# EAGLE design rekickNewGeneration002 (EAGLE 5.07)

## Sheet 1 of 4
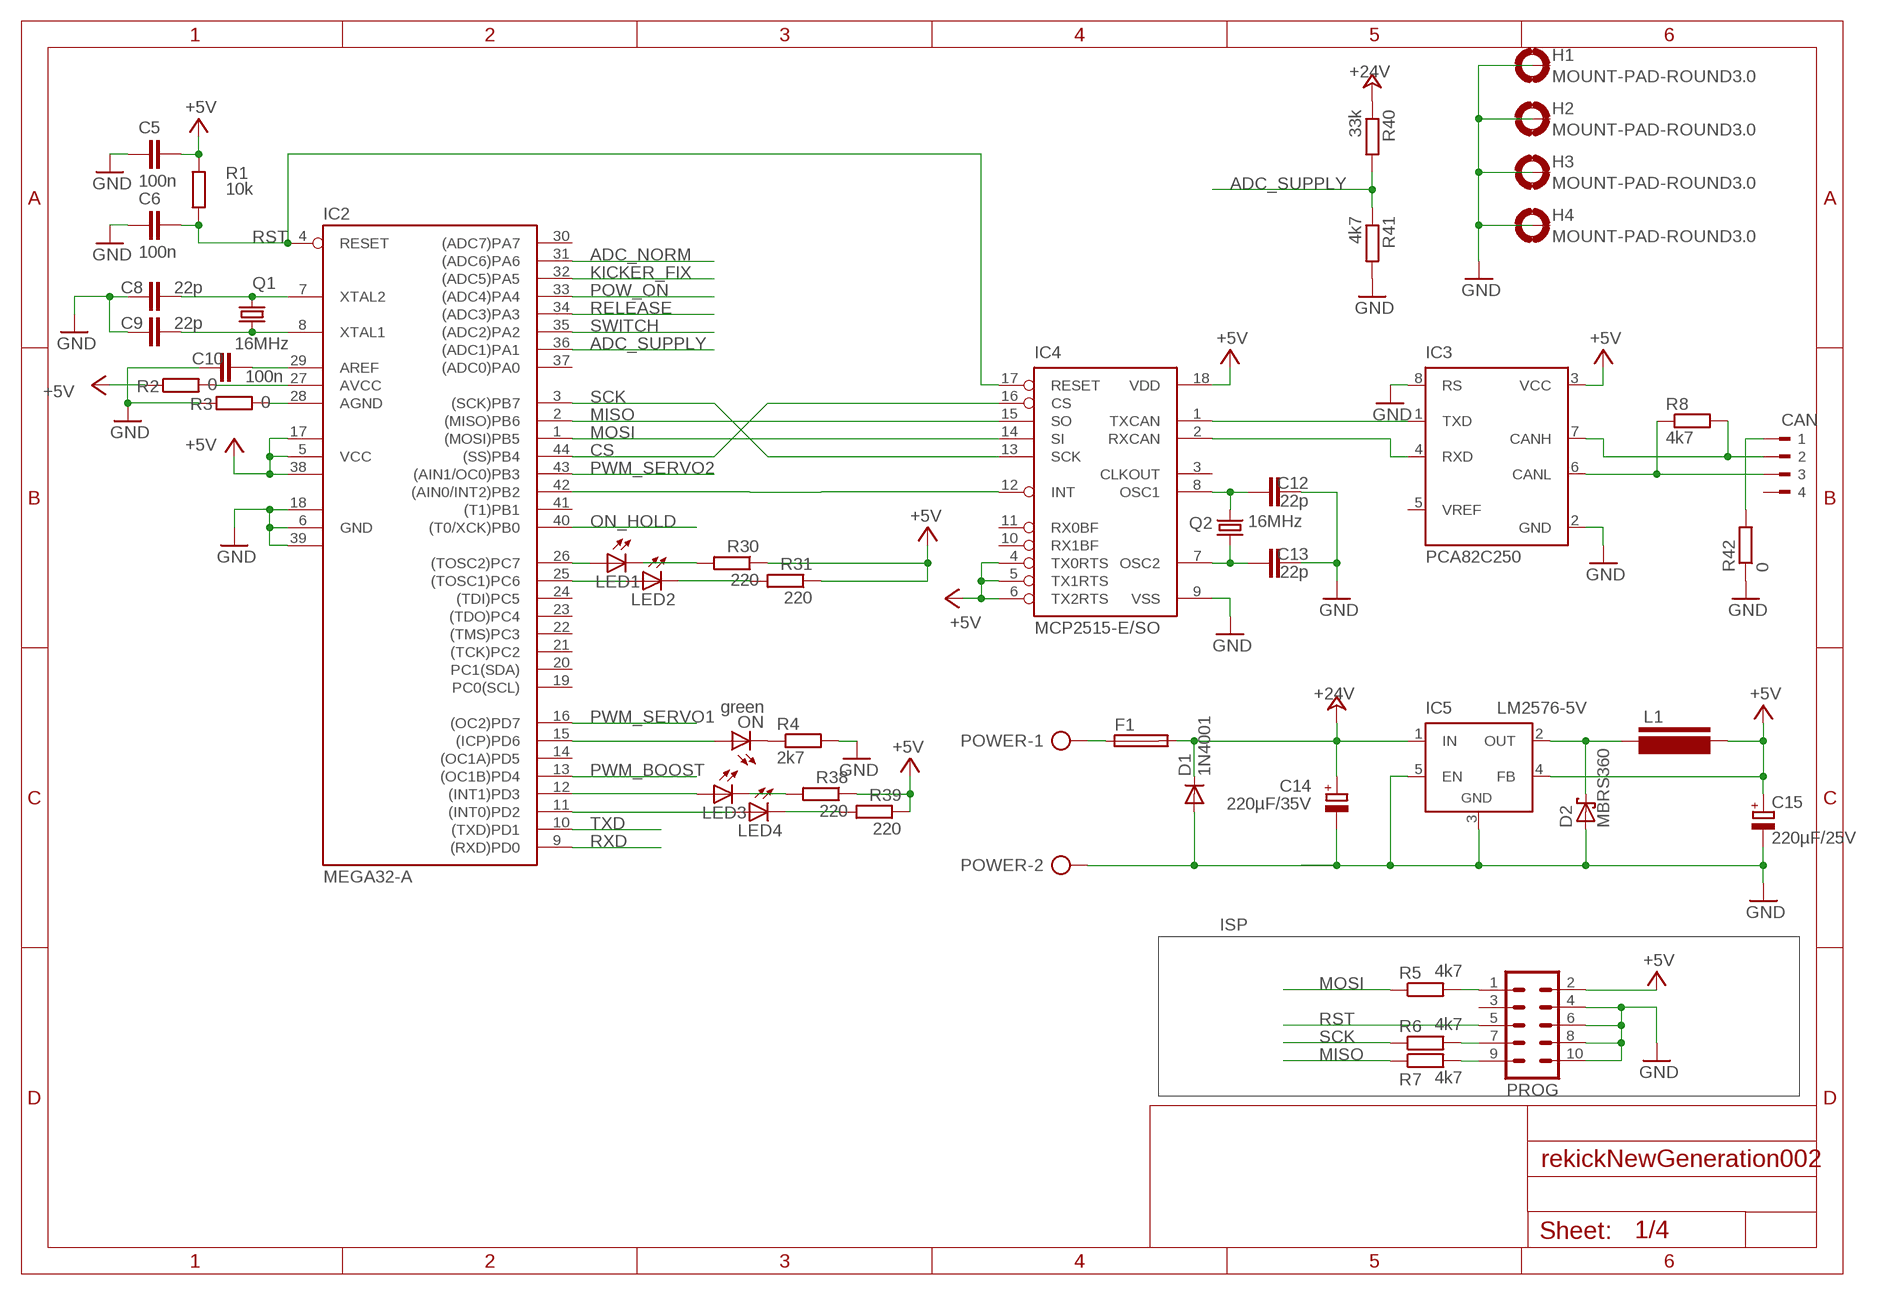
[diagram p0: schematic, sheet 1]

### Parts
C5  100n  C-EUC0603  [C0603]
C6  100n  C-EUC0603  [C0603]
C8  22p  C-EUC0603  [C0603]
C9  22p  C-EUC0603  [C0603]
C10  100n  C-EUC0603  [C0603]
C12  22p  C-EUC0603  [C0603]
C13  22p  C-EUC0603  [C0603]
C14  220µF/35V  CPOL-EUE5-10.5  [E5-10,5]
C15  220µF/25V  CPOL-EUE3.5-10  [E3,5-10]
CAN  90-4  [90-4]
D1  1N4001  1N4004  [DO41-10]
D2  MBRS360  SCHOTTKY-DIODESMC  [SMC]
F1  SH22,5A  [SH22,5A]
H1  MOUNT-PAD-ROUND3.0  [3,0-PAD]
H2  MOUNT-PAD-ROUND3.0  [3,0-PAD]
H3  MOUNT-PAD-ROUND3.0  [3,0-PAD]
H4  MOUNT-PAD-ROUND3.0  [3,0-PAD]
IC2  MEGA32-A  [TQFP44]
IC3  PCA82C250  [DIL08]
IC4  MCP2515-E/SO  [SO18L]
IC5  LM2576-5V  LM2596TV  [TO220-51]
L1  L-PISR  [PISR]
LED1  LEDCHIP-LED0805  [CHIP-LED0805]
LED2  LEDCHIP-LED0805  [CHIP-LED0805]
LED3  LEDCHIP-LED0805  [CHIP-LED0805]
LED4  LEDCHIP-LED0805  [CHIP-LED0805]
ON  green  LED3MM  [LED3MM]
POWER  AK500/2-H  [AK500/2-H]
PROG  ML10  [ML10]
Q1  16MHz  CRYSTALHC49S  [HC49/S]
Q2  16MHz  CRYSTALHC49U-V  [HC49U-V]
R1  10k  R-EU_R0805  [R0805]
R2  0  R-EU_R0805  [R0805]
R3  0  R-EU_R0805  [R0805]
R4  2k7  R-EU_R0805  [R0805]
R5  4k7  R-EU_R0805  [R0805]
R6  4k7  R-EU_R0805  [R0805]
R7  4k7  R-EU_R0805  [R0805]
R8  4k7  R-EU_R0805  [R0805]
R30  220  R-EU_R0805  [R0805]
R31  220  R-EU_R0805  [R0805]
R38  220  R-EU_R0805  [R0805]
R39  220  R-EU_R0805  [R0805]
R40  33k  R-EU_R0805  [R0805]
R41  4k7  R-EU_R0805  [R0805]
R42  0  R-EU_R0805  [R0805]

### Nets
+5V [Power]: C5.2 C15.+ IC2.5(VCC) IC2.17(VCC1) IC2.38(VCC2) IC3.3(VCC) IC4.4(TX0RTS) IC4.5(TX1RTS) IC4.6(TX2RTS) IC4.18(VDD) IC5.4(FB) L1.P$2 PROG.2 R1.2 R2.1 R30.1 R31.1 R38.1 R39.1 ; also sheet 2,3
+24V [Power]: C14.+ D1.C F1.2 IC5.1(IN) R40.1 ; also sheet 2
ADC_NORM: IC2.31((ADC6)PA6) ; also sheet 4
ADC_SUPPLY: IC2.36((ADC1)PA1) R40.2 R41.1
CS: IC2.44((SS)PB4) IC4.16(CS)
GND [Power]: C5.1 C6.1 C8.1 C9.2 C10.1 C12.2 C13.2 C14.- C15.- D1.A D2.A H1.B3,0(MOUNT) H2.B3,0(MOUNT) H3.B3,0(MOUNT) H4.B3,0(MOUNT) IC2.6(GND) IC2.18(GND1) IC2.39(GND2) IC3.2(GND) IC3.8(RS) IC4.9(VSS) IC5.3(GND) IC5.5(EN) POWER.2 PROG.4 PROG.6 PROG.8 PROG.10 R3.1 R4.2 R41.2 R42.1 ; also sheet 2,3,4
KICKER_FIX: IC2.32((ADC5)PA5)
MISO: IC2.2((MISO)PB6) IC4.15(SO) R7.1
MOSI: IC2.1((MOSI)PB5) IC4.14(SI) R5.1
N$1: IC2.15((ICP)PD6) ON.A
N$2: C10.2 IC2.29(AREF)
N$3: IC2.27(AVCC) R2.2
N$4: C9.1 IC2.8(XTAL1) Q1.1
N$5: C8.2 IC2.7(XTAL2) Q1.2
N$6: PROG.1 R5.2
N$7: IC2.28(AGND) R3.2
N$8: PROG.7 R6.2
N$9: PROG.9 R7.2
N$12: IC3.1(TXD) IC4.1(TXCAN)
N$22: IC3.4(RXD) IC4.2(RXCAN)
N$24: CAN.3 IC3.6(CANL) R8.1
N$30 [Power]: D2.C IC5.2(OUT) L1.P$1
N$31: ON.K(C) R4.1
N$42: IC2.42((AIN0/INT2)PB2) IC4.12(INT)
N$43 [Power]: F1.1 POWER.1
N$44: LED2.C R31.2
N$45: LED1.C R30.2
N$46: CAN.1 R42.2
N$48: IC2.26((TOSC2)PC7) LED1.A
N$49: IC2.25((TOSC1)PC6) LED2.A
N$53: C13.1 IC4.7(OSC2) Q2.1
N$54: C12.1 IC4.8(OSC1) Q2.2
N$58: LED3.C R38.2
N$59: CAN.2 IC3.7(CANH) R8.2
N$60: LED4.C R39.2
N$61: IC2.12((INT1)PD3) LED3.A
N$62: IC2.11((INT0)PD2) LED4.A
ON_HOLD: IC2.40((T0/XCK)PB0) ; also sheet 3
POW_ON: IC2.33((ADC4)PA4) ; also sheet 2
PWM_BOOST: IC2.13((OC1B)PD4) ; also sheet 2
PWM_SERVO1: IC2.16((OC2)PD7)
PWM_SERVO2: IC2.43((AIN1/OC0)PB3)
RELEASE: IC2.34((ADC3)PA3) ; also sheet 2
RST: C6.2 IC2.4(RESET) IC4.17(RESET) PROG.5 R1.1 ; also sheet 2
RXD: IC2.9((RXD)PD0)
SCK: IC2.3((SCK)PB7) IC4.13(SCK) R6.1
SWITCH: IC2.35((ADC2)PA2)
TXD: IC2.10((TXD)PD1)
Unconnected: CAN.4 IC2.14((OC1A)PD5) IC2.19(PC0(SCL)) IC2.20(PC1(SDA)) IC2.21((TCK)PC2) IC2.22((TMS)PC3) IC2.23((TDO)PC4) IC2.24((TDI)PC5) IC2.30((ADC7)PA7) IC2.37((ADC0)PA0) IC2.41((T1)PB1) IC3.5(VREF) IC4.3(CLKOUT) IC4.10(RX1BF) IC4.11(RX0BF) PROG.3

### Notes on the sheet
- ISP

## Sheet 2 of 4
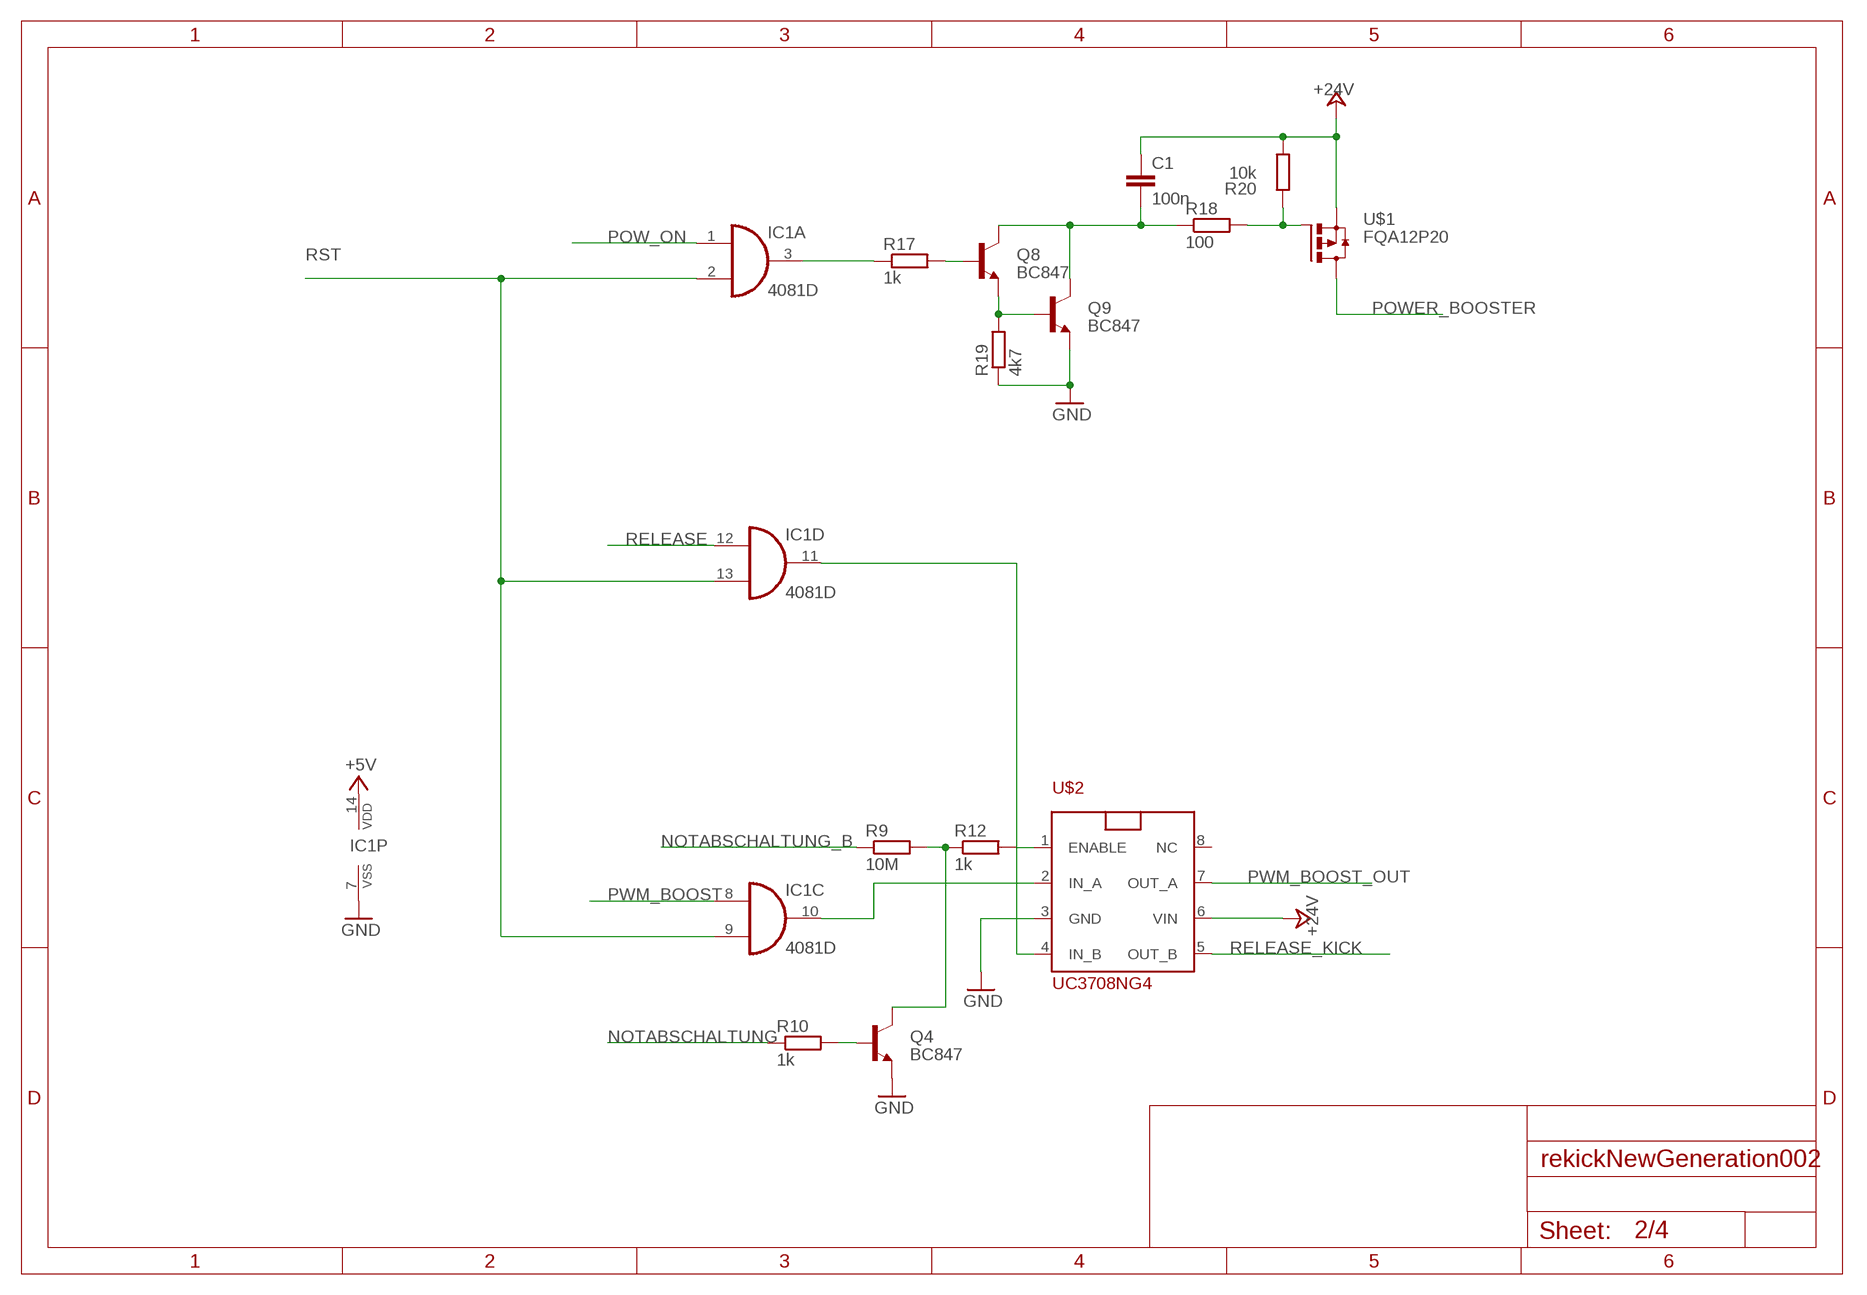
[diagram p1: schematic, sheet 2]

### Parts
C1  100n  C-EUC0603  [C0603]
IC1  4081D  [SO14]
Q4  BC847  BC817-25SMD  [SOT23-BEC]
Q8  BC847  BC817-25SMD  [SOT23-BEC]
Q9  BC847  BC817-25SMD  [SOT23-BEC]
R9  10M  R-EU_R0805  [R0805]
R10  1k  R-EU_R0805  [R0805]
R12  1k  R-EU_R0805  [R0805]
R17  1k  R-EU_R0805  [R0805]
R18  100  R-EU_R0805  [R0805]
R19  4k7  R-EU_R0805  [R0805]
R20  10k  R-EU_R0805  [R0805]
U$1  FQA12P20  [TO247BV]
U$2  UC3708NG4  [DIL08]

### Nets
+5V [Power]: IC1.14(P:VDD) ; also sheet 1,3
+24V [Power]: C1.1 R20.1 U$1.S U$2.6(VIN) ; also sheet 1
GND [Power]: IC1.7(P:VSS) Q4.E Q9.E R19.1 U$2.3(GND) ; also sheet 1,3,4
N$11: R12.2 U$2.1(ENABLE)
N$15: Q4.B R10.2
N$19: IC1.11(D:O) U$2.4(IN_B)
N$29: R18.2 R20.2 U$1.G
N$36: IC1.10(C:O) U$2.2(IN_A)
N$47: IC1.3(A:O) R17.1
N$63 [Power]: C1.2 Q8.C Q9.C R18.1
N$64: Q8.E Q9.B R19.2
N$65: Q8.B R17.2
N$100: Q4.C R9.2 R12.1
NOTABSCHALTUNG: R10.1 ; also sheet 3
NOTABSCHALTUNG_B: R9.1 ; also sheet 3
POW_ON: IC1.1(A:I0) ; also sheet 1
POWER_BOOSTER: U$1.D ; also sheet 3
PWM_BOOST: IC1.8(C:I0) ; also sheet 1
PWM_BOOST_OUT: U$2.7(OUT_A) ; also sheet 3
RELEASE: IC1.12(D:I0) ; also sheet 1
RELEASE_KICK: U$2.5(OUT_B) ; also sheet 4
RST: IC1.2(A:I1) IC1.9(C:I1) IC1.13(D:I1) ; also sheet 1
Unconnected: IC1.4(B:O) IC1.5(B:I0) IC1.6(B:I1) U$2.8(NC)

## Sheet 3 of 4
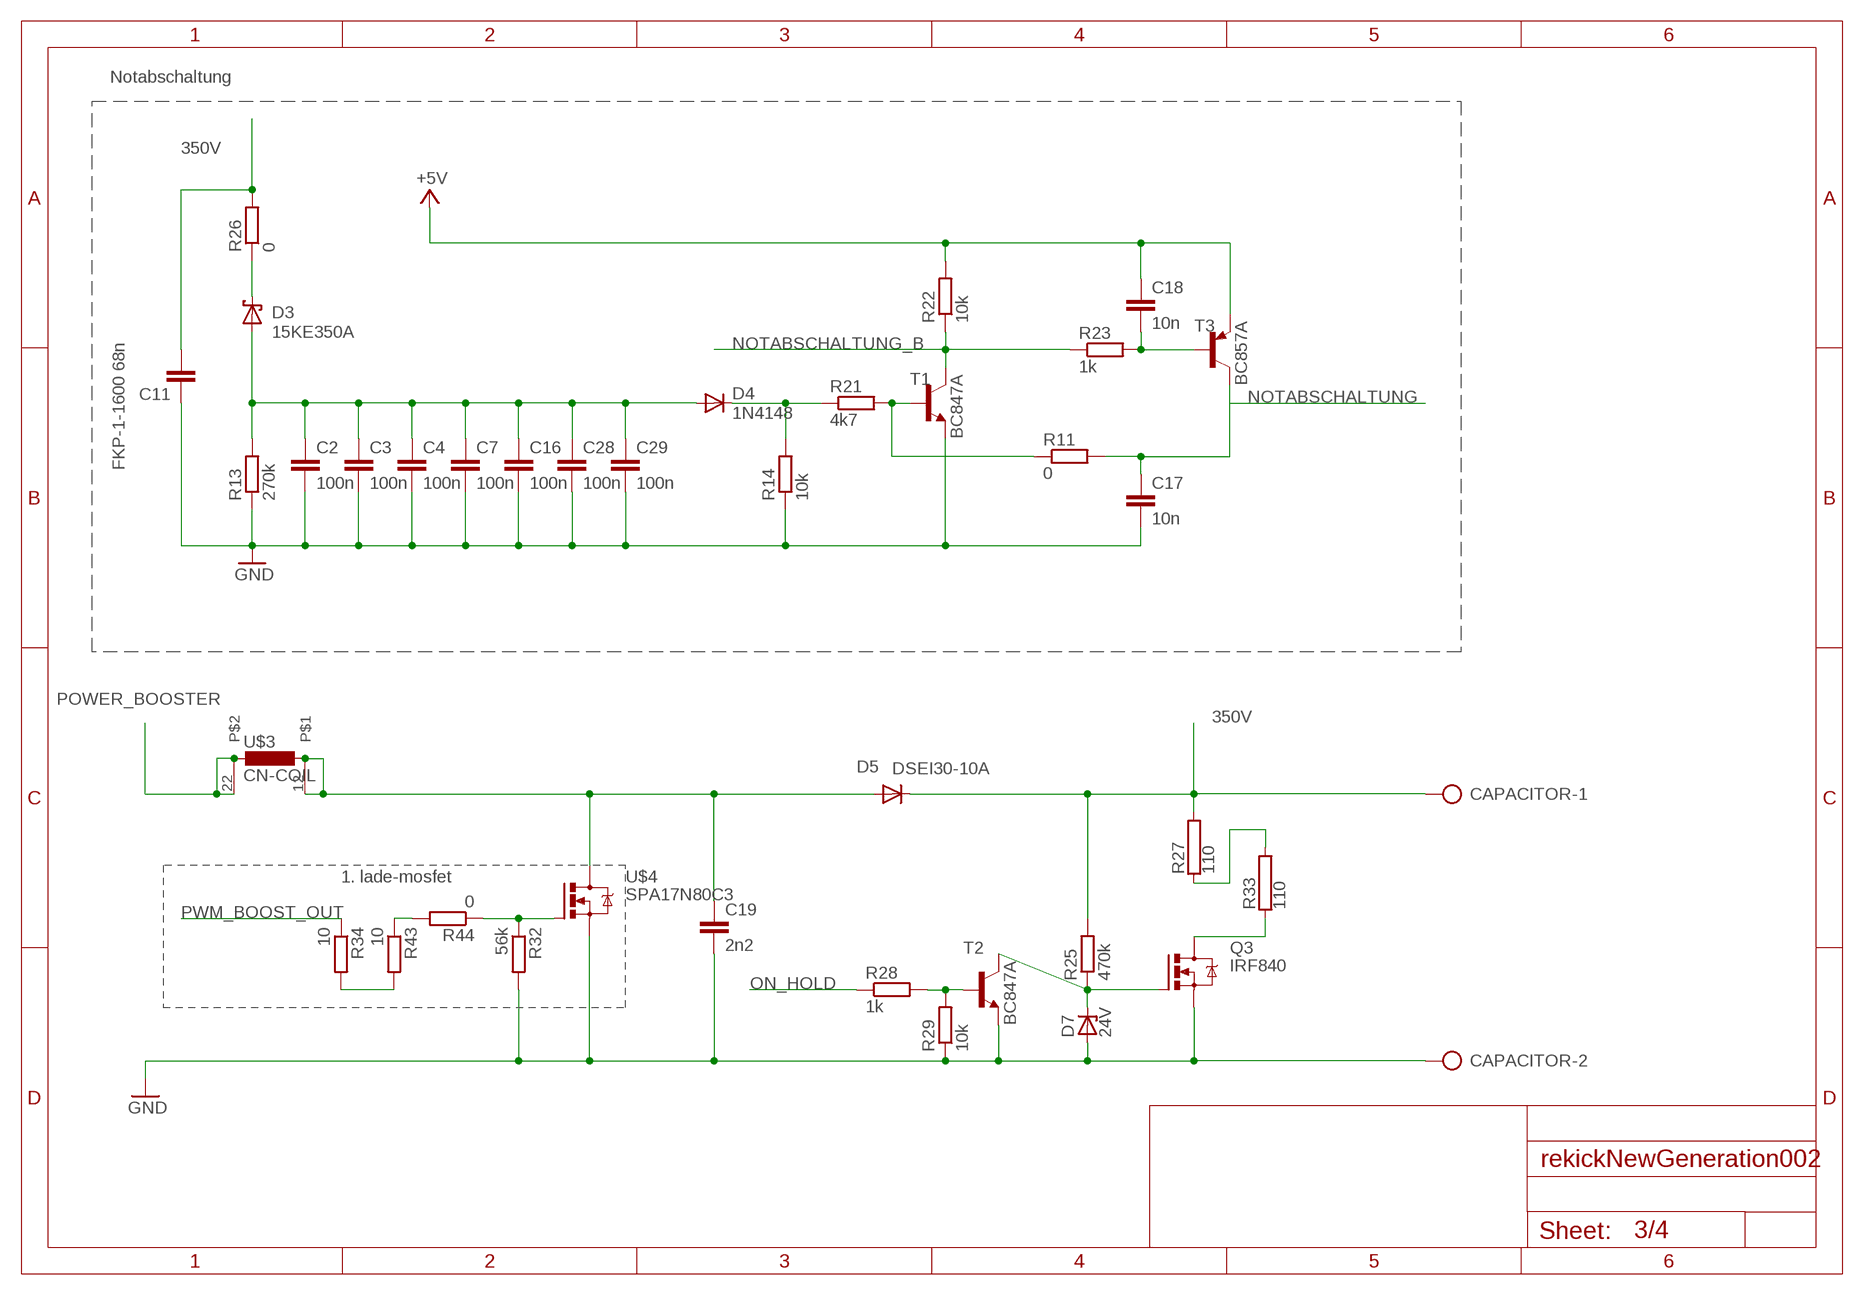
[diagram p2: schematic, sheet 3]

### Parts
C2  100n  C-EUC0603  [C0603]
C3  100n  C-EUC0603  [C0603]
C4  100n  C-EUC0603  [C0603]
C7  100n  C-EUC0603  [C0603]
C11  FKP-1-1600 68n  C-EU375-192X418  [C375-192X418]
C16  100n  C-EUC0603  [C0603]
C17  10n  C-EUC0603  [C0603]
C18  10n  C-EUC0603  [C0603]
C19  2n2  C-EU150-054X183  [C150-054X183]
C28  100n  C-EUC0603  [C0603]
C29  100n  C-EUC0603  [C0603]
CAPACITOR  AK500/2-H  [AK500/2-H]
D3  15KE350A  15KEXX  [CB429-17]
D4  1N4148  [DO35-10]
D5  DSEI30-10A  DEIS10-30A  [TO247AD]
D7  24V  ZENER-DIODEDO35Z10  [DO35Z10]
Q3  IRF840  IRF740  [TO220BV]
R11  0  R-EU_R0805  [R0805]
R13  270k  R-EU_R0805  [R0805]
R14  10k  R-EU_R0805  [R0805]
R21  4k7  R-EU_R0805  [R0805]
R22  10k  R-EU_R0805  [R0805]
R23  1k  R-EU_R0805  [R0805]
R25  470k  R-EU_R0805  [R0805]
R26  0  R-EU_0207/15  [0207/15]
R27  110  RHS25  [HS25]
R28  1k  R-EU_R0805  [R0805]
R29  10k  R-EU_R0805  [R0805]
R32  56k  R-EU_R0805  [R0805]
R33  110  RHS25  [HS25]
R34  10  R-EU_R0805  [R0805]
R43  10  R-EU_R0805  [R0805]
R44  0  R-EU_R0805  [R0805]
T1  BC847A  BC817-25-NPN-SOT23-BEC  [SOT23-BEC]
T2  BC847A  BC817-25-NPN-SOT23-BEC  [SOT23-BEC]
T3  BC857A  BC807-25-PNP-SOT23-BEC  [SOT23-BEC]
U$3  CN-COIL  [CN-TJ6-U1-2]
U$4  SPA17N80C3  [TO220BV]

### Nets
350V: C11.2 CAPACITOR.1 D5.K(C) R25.2 R26.2 R27.2 ; also sheet 4
+5V [Power]: C18.1 R22.2 T3.E ; also sheet 1,2
GND [Power]: C2.2 C3.2 C4.2 C7.2 C11.1 C16.2 C17.2 C19.2 C28.2 C29.2 CAPACITOR.2 D7.A Q3.S R13.1 R14.1 R29.1 R32.2 T1.E T2.E U$4.S ; also sheet 1,2,4
N$14: C2.1 C3.1 C4.1 C7.1 C16.1 C28.1 C29.1 D3.A D4.A R13.2
N$16: C18.2 R23.2 T3.B
N$18: R11.1 R21.2 T1.B
N$20: R34.2 R43.2
N$23 [Power]: C19.1 D5.A U$3.11 U$3.12 U$4.D
N$25: R32.1 R44.1 U$4.G
N$27: D4.C R14.2 R21.1
N$28: D3.C R26.1
N$32: Q3.D R33.1
N$33: R27.1 R33.2
N$34: D7.C Q3.G R25.1 T2.C
N$38: R28.2 R29.2 T2.B
N$50: R43.1 R44.2
NOTABSCHALTUNG: C17.1 R11.2 T3.C ; also sheet 2
NOTABSCHALTUNG_B: R22.1 R23.1 T1.C ; also sheet 2
ON_HOLD: R28.1 ; also sheet 1
POWER_BOOSTER: U$3.21 U$3.22 ; also sheet 2
PWM_BOOST_OUT: R34.1 ; also sheet 2

### Notes on the sheet
- Notabschaltung
- 1. lade-mosfet

## Sheet 4 of 4
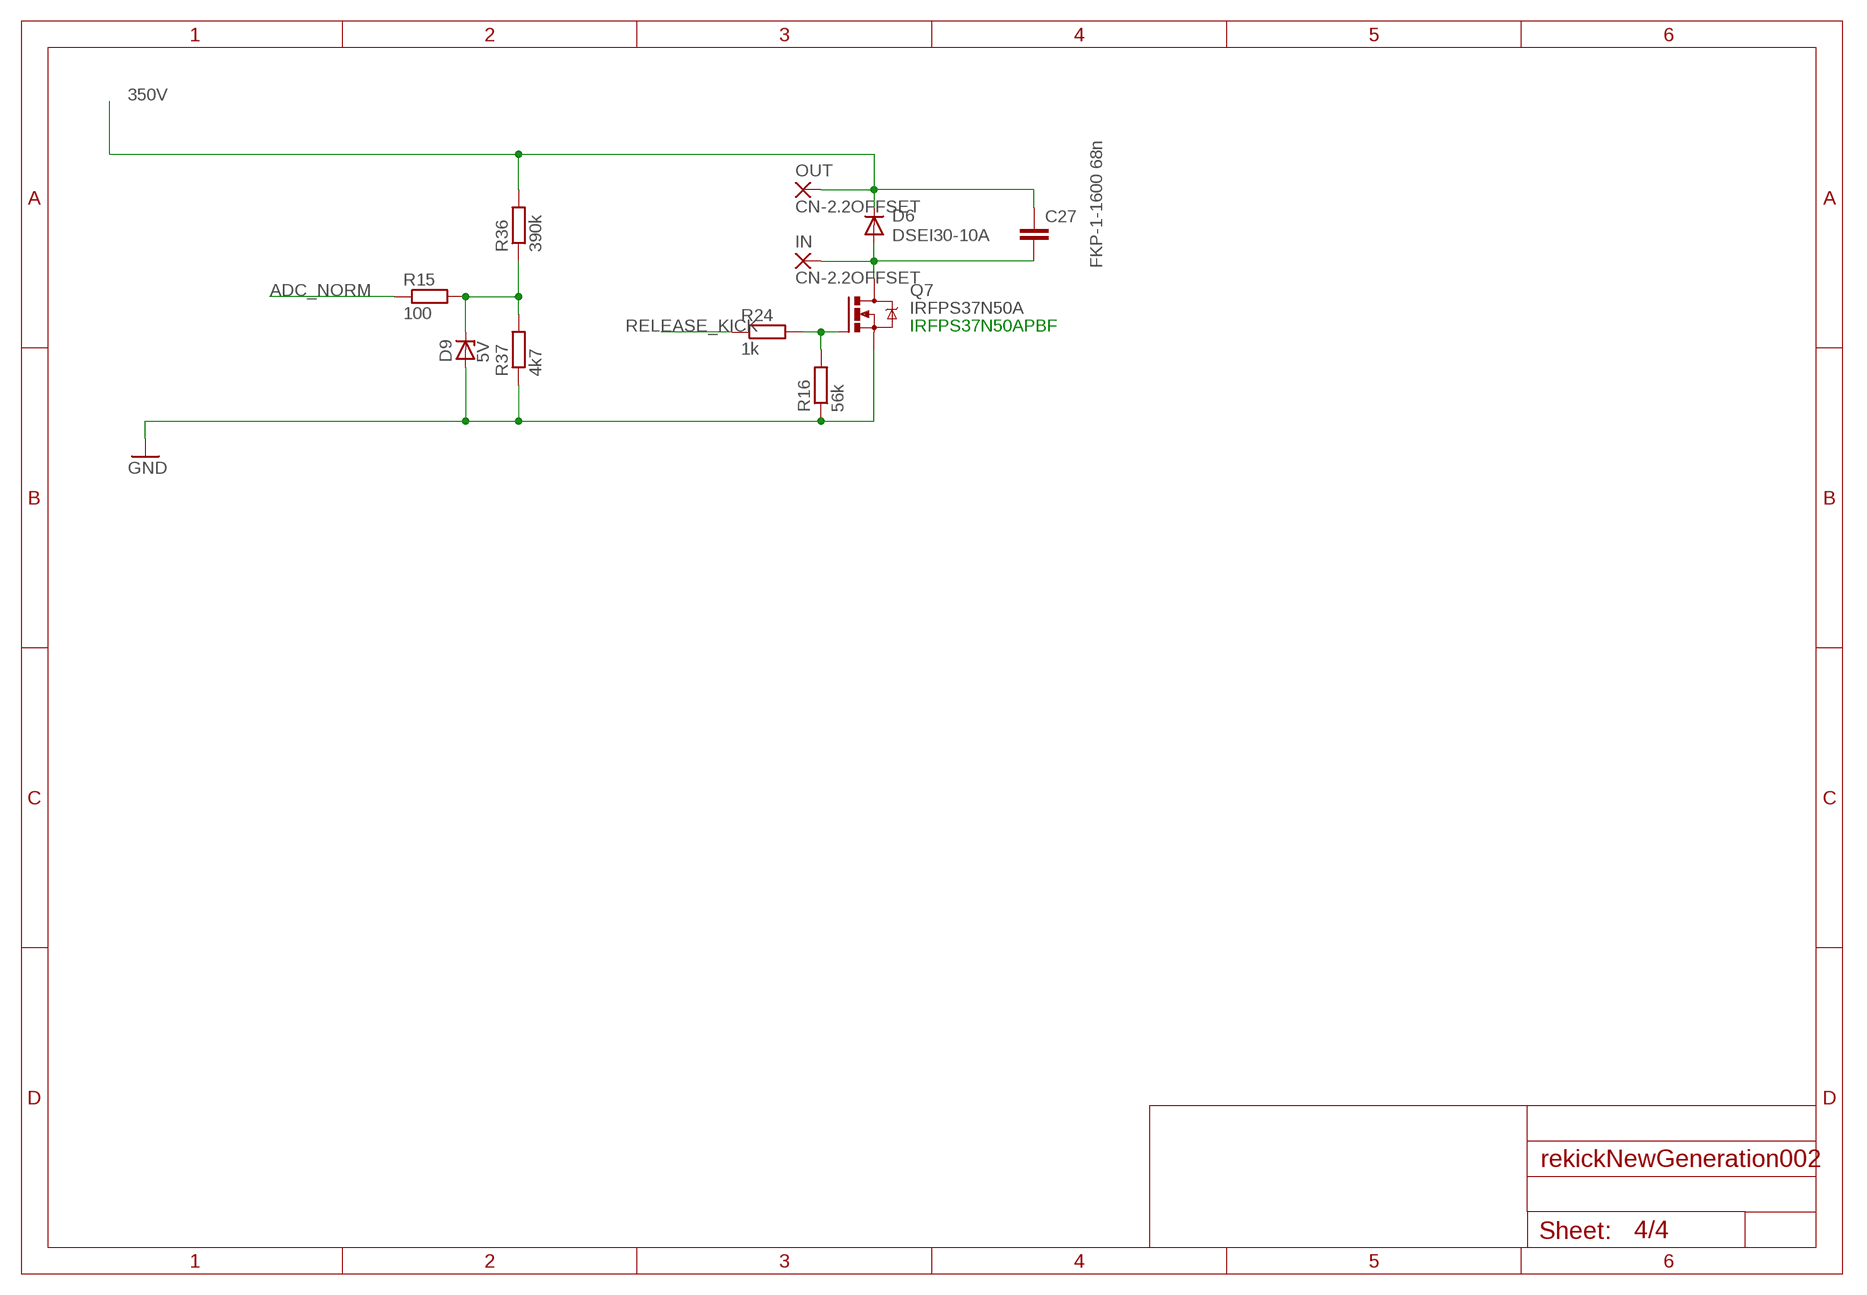
[diagram p3: schematic, sheet 4]

### Parts
C27  FKP-1-1600 68n  C-EU375-192X418  [C375-192X418]
D6  DSEI30-10A  DEIS10-30A  [TO247AD]
D9  5V  ZENER-DIODESOT23  [SOT23]
IN  CN-2.2OFFSET  [CN-2,1]
OUT  CN-2.2OFFSET  [CN-2,1]
Q7  IRFPS37N50A  IRFPC40  [TO247BV]
R15  100  R-EU_R0805  [R0805]
R16  56k  R-EU_R0805  [R0805]
R24  1k  R-EU_R0805  [R0805]
R36  390k  R-EU_0207/15  [0207/15]
R37  4k7  R-EU_0207/15  [0207/15]

### Nets
350V: C27.1 D6.K(C) OUT.>NAME(P) R36.2 ; also sheet 3
ADC_250V1: D9.3(C) R15.2 R36.1 R37.2
ADC_NORM: R15.1 ; also sheet 1
GND [Power]: D9.1(A) Q7.S R16.1 R37.1 ; also sheet 1,2,3
N$10: Q7.G R16.2 R24.2
N$55: C27.2 D6.A IN.>NAME(P) Q7.D
RELEASE_KICK: R24.1 ; also sheet 2

### Notes on the sheet
- IRFPS37N50APBF

## Library data of the parts
C1-C13 C16-C19 C27-C29 = rcl:C-EU: CAPACITOR, European symbol
C14 C15 = rcl:CPOL-EU: POLARIZED CAPACITOR, European symbol
CAN = con-weidmueller-sl35:90-4: WEIDMUELLER CLAMP CONNECTOR
CAPACITOR POWER = con-ptr500:AK500/2-H: CONNECTOR Aug. 2004 / PTR Meßtechnik: Die Bezeichnung der Serie AK505 wurde geändert. Es handelt sich hierbei um AK500 in horizontaler Ausführung.
D1 = diode:1N4004: DIODE general purpose rectifier, 1 A
D2 = diode:SCHOTTKY-DIODE: Schottky Diode
D3 = diode:15KEXX: DIODE
D4 = diode:1N4148: DIODE high speed (Philips)
D5 D6 = carpenoctem:DEIS10-30A
D7 D9 = diode:ZENER-DIODE: Z-Diode
F1 = fuse:SH22,5A: FUSE HOLDER grid 22,5mm, isolated cap OGN0031 8201, Schurter (Buerklin)
H1-H4 = holes:MOUNT-PAD-ROUND: MOUNTING PAD, round
IC1 = 40xx:4081: Quad 2-input AND
IC2 = atmel:MEGA32: MICROCONTROLLER 32 Kbytes FLASH 2 Kbytes SRAM 1 Kbytes EEPROM USART 8-channel 10 bit ADC Source: www.atmel.com .. doc2503.pdf
IC3 = micro-philips:PCA82C250: CAN CONTROLLER INTERFACE
IC4 = mcp2515:MCP2515
IC5 = linear:LM2596T: STEP-DOWN VOLTAGE REGULATOR
IN OUT = mywirepad:CN-2.2OFFSET
L1 = L-PISR:L-PISR: Fastron SMD Power Inductors (also Shielded) - PISR Series Data Sheet <http://www.fastrongroup.com/products/inductors/pdf/PISR.pdf> Part No Inductance L (µH) fL (MHz) Tol ± (%) SRF min (MHz) DCR max (Ω) Rated DC Current | sat (A) | Δ T = 40°C (A) PISR-1R0M-04 1.0 0.1 20 164 0.009 21 8.60 PISR-2R2M-04 2.2 0.1 20 95 0.014 16 7.10 PISR-3R3M-04 3.3 0.1 20 72 0.017 15 6.40 PISR-4R7M-04 4.7 0.1 20 52 0.019 13 5.80 PISR-5R6M-04 5.6 0.1 20 41 0.022 12 5.50 PISR-6R8M-04 6.8 0.1 20 35 0.024 11 5.20 PISR-100M-04 10 0.1 20 24 0.029 10 4.50 PISR-150M-04 15 0.1 20 20 0.035 8.0 4.10 PISR-220M-04 22 0.1 20 15 0.04 7.0 3.60 PISR-330M-04 33 0.1 20 10 0.06 5.6 3.10 PISR-470M-04 47 0.1 20 8 0.07 4.6 2.70 PISR-680M-04 68 0.1 20 6.5 0.10 3.6 2.30 PISR-101M-04 100 0.1 20 5.2 0.17 3.1 1.90 PISR-151M-04 150 0.1 20 4.2 0.22 2.6 1.60 PISR-221M-04 220 0.1 20 3.3 0.34 2.2 1.30 PISR-331M-04 330 0.1 20 2.7 0.52 1.9 1.10 PISR-471M-04 470 0.1 20 2.1 0.76 1.4 0.85 PISR-681M-04 680 0.1 20 1.8 1.1 1.2 0.74 PISR-102M-04 1000 0.1 20 1.3 1.7 1.0 0.57
LED1-LED4 ON = led:LED: LED OSRAM: - CHIPLED LG R971, LG N971, LY N971, LG Q971, LY Q971, LO R971, LY R971 LH N974, LH R974 LS Q976, LO Q976, LY Q976 LO Q996 - Hyper CHIPLED LW Q18S LB Q993, LB Q99A, LB R99A - SideLED LS A670, LO A670, LY A670, LG A670, LP A670 LB A673, LV A673, LT A673, LW A673 LH A674 LY A675 LS A676, LA A676, LO A676, LY A676, LW A676 LS A679, LY A679, LG A679 - Hyper Micro SIDELED® LS Y876, LA Y876, LO Y876, LY Y876 LT Y87S - SmartLED LW L88C, LW L88S LB L89C, LB L89S, LG L890 LS L89K, LO L89K, LY L89K LS L896, LA L896, LO L896, LY L896 - TOPLED LS T670, LO T670, LY T670, LG T670, LP T670 LSG T670, LSP T670, LSY T670, LOP T670, LYG T670 LG T671, LOG T671, LSG T671 LB T673, LV T673, LT T673, LW T673 LH T674 LS T676, LA T676, LO T676, LY T676, LB T676, LH T676, LSB T676, LW T676 LB T67C, LV T67C, LT T67C, LS T67K, LO T67K, LY T67K, LW E67C LS E67B, LA E67B, LO E67B, LY E67B, LB E67C, LV E67C, LT E67C LW T67C LS T679, LY T679, LG T679 LS T770, LO T770, LY T770, LG T770, LP T770 LB T773, LV T773, LT T773, LW T773 LH T774 LS E675, LA E675, LY E675, LS T675 LS T776, LA T776, LO T776, LY T776, LB T776 LHGB T686 LT T68C, LB T68C - Hyper Mini TOPLED® LB M676 - Mini TOPLED Santana® LG M470 LS M47K, LO M47K, LY M47K Source: http://www.osram.convergy.de - LUMILED® LXK2-PW12-R00, LXK2-PW12-S00, LXK2-PW14-U00, LXK2-PW14-V00 LXK2-PM12-R00, LXK2-PM12-S00, LXK2-PM14-U00 LXK2-PE12-Q00, LXK2-PE12-R00, LXK2-PE12-S00, LXK2-PE14-T00, LXK2-PE14-U00 LXK2-PB12-K00, LXK2-PB12-L00, LXK2-PB12-M00, LXK2-PB14-N00, LXK2-PB14-P00, LXK2-PB14-Q00 LXK2-PR12-L00, LXK2-PR12-M00, LXK2-PR14-Q00, LXK2-PR14-R00 LXK2-PD12-Q00, LXK2-PD12-R00, LXK2-PD12-S00 LXK2-PH12-R00, LXK2-PH12-S00 LXK2-PL12-P00, LXK2-PL12-Q00, LXK2-PL12-R00 Source: www.luxeon.com
PROG = con-harting-ml:ML10: HARTING
Q1 Q2 = crystal:CRYSTAL: CRYSTAL
Q3 = transistor-power:IRF740: N-CHANNEL MOS FET
Q4 Q8 Q9 = transistor-npn:BC817*: NPN Transistor
Q7 = transistor-power:IRFPC40: N-CHANNEL MOS FET
R1-R26 R28-R32 R34 R36-R44 = rcl:R-EU_: RESISTOR, European symbol
R27 R33 = resistor-power:R: Power Resitor
T1 T2 = transistor:*-NPN-: NPN Transistror
T3 = transistor:*-PNP-: PNP Transistror
U$1 = carpenoctem:FQA12P20
U$2 = rekickNewGeneration:UC3708NG4
U$3 = myrcl:CN-COIL
U$4 = rekickNewGeneration:SPA17N80C3

## Net classes
1 Power: width 0.406 mm
2 High Power: width 2 mm

## Board
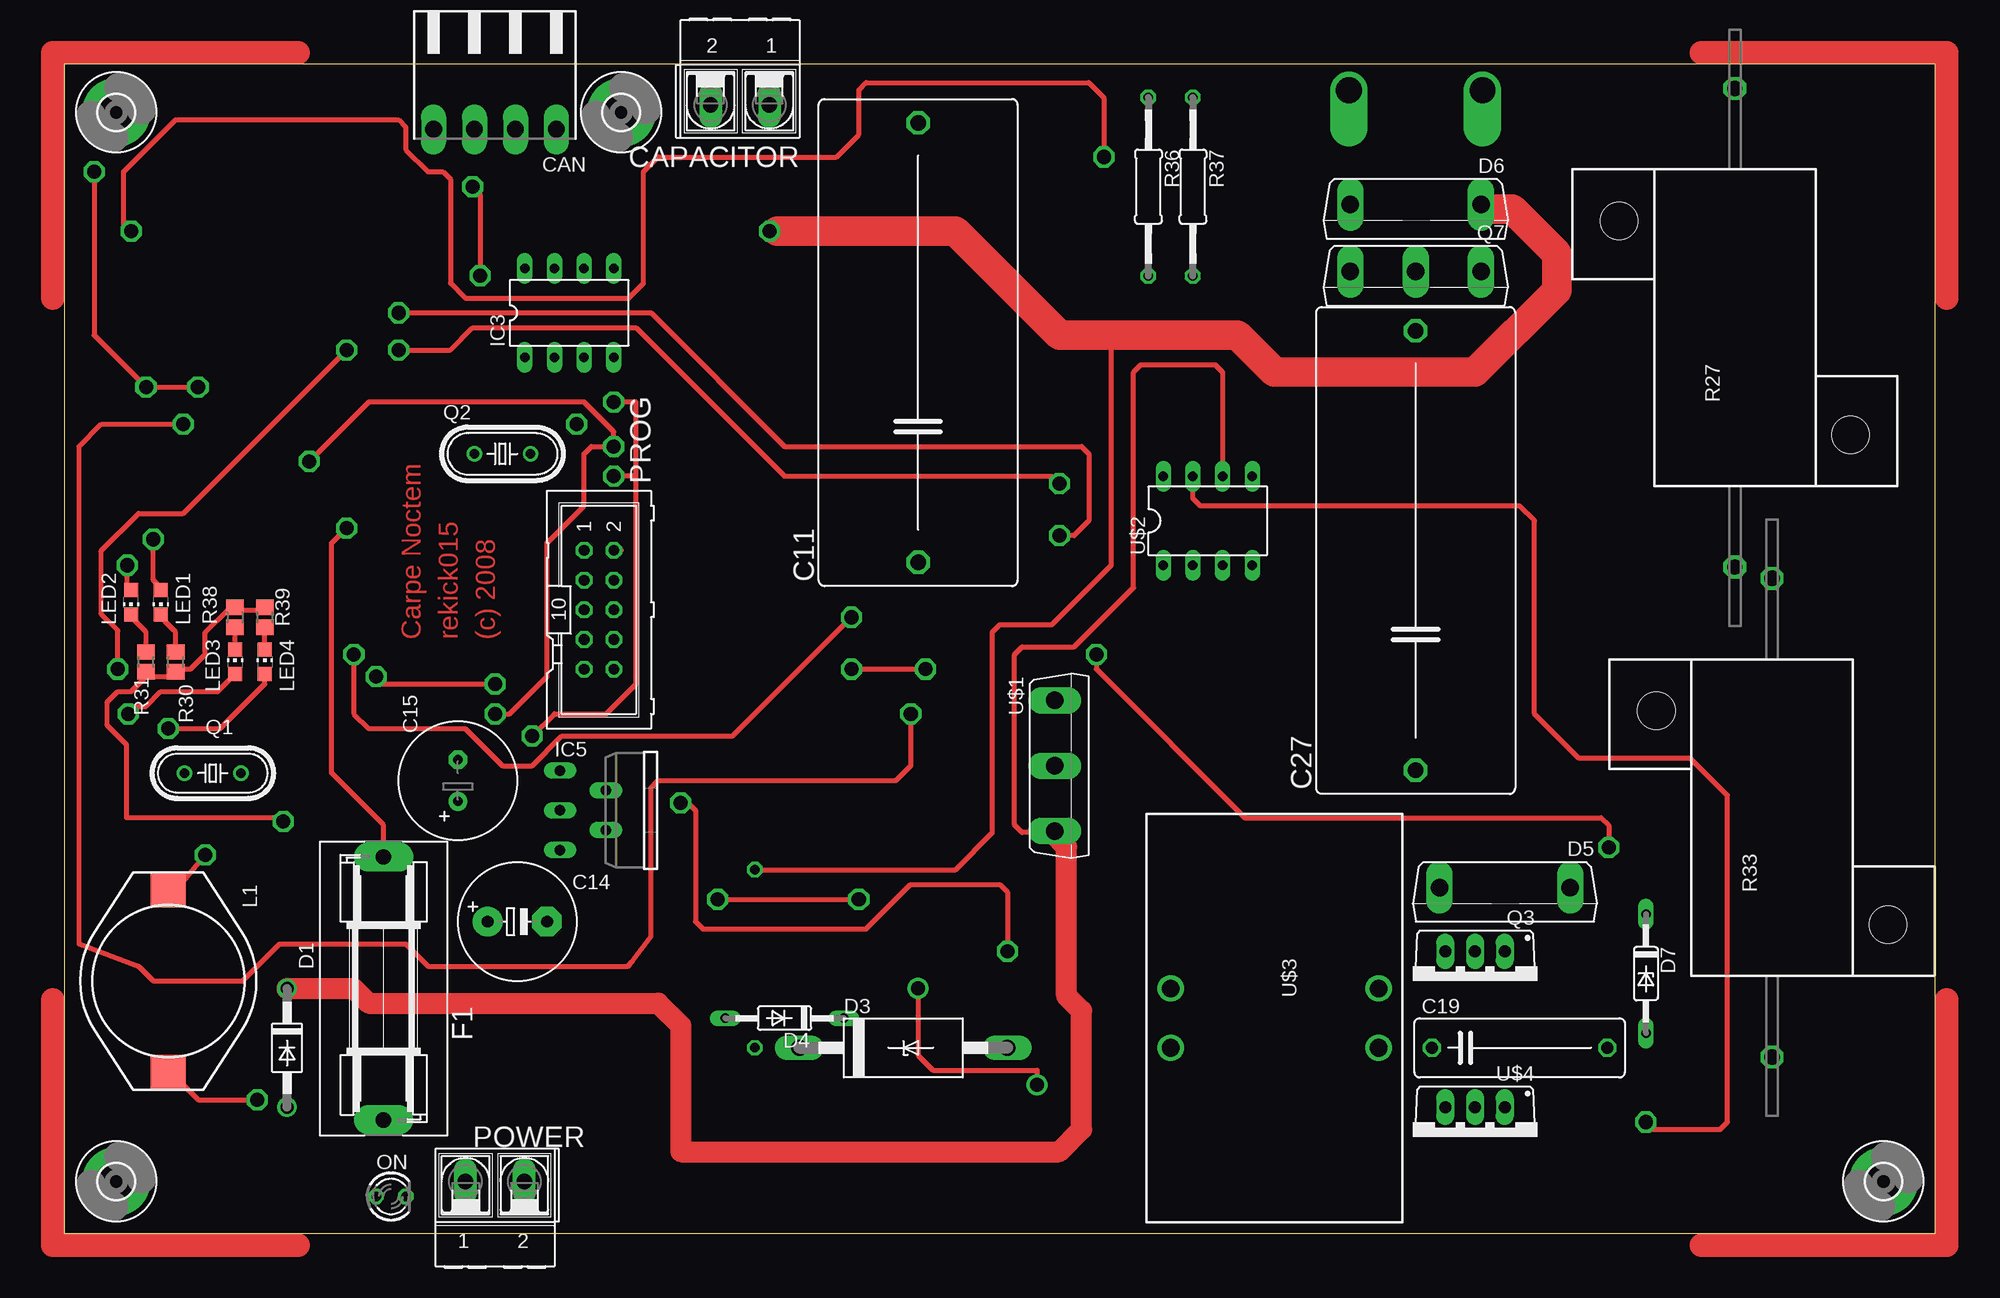
[diagram p4: board, top side]
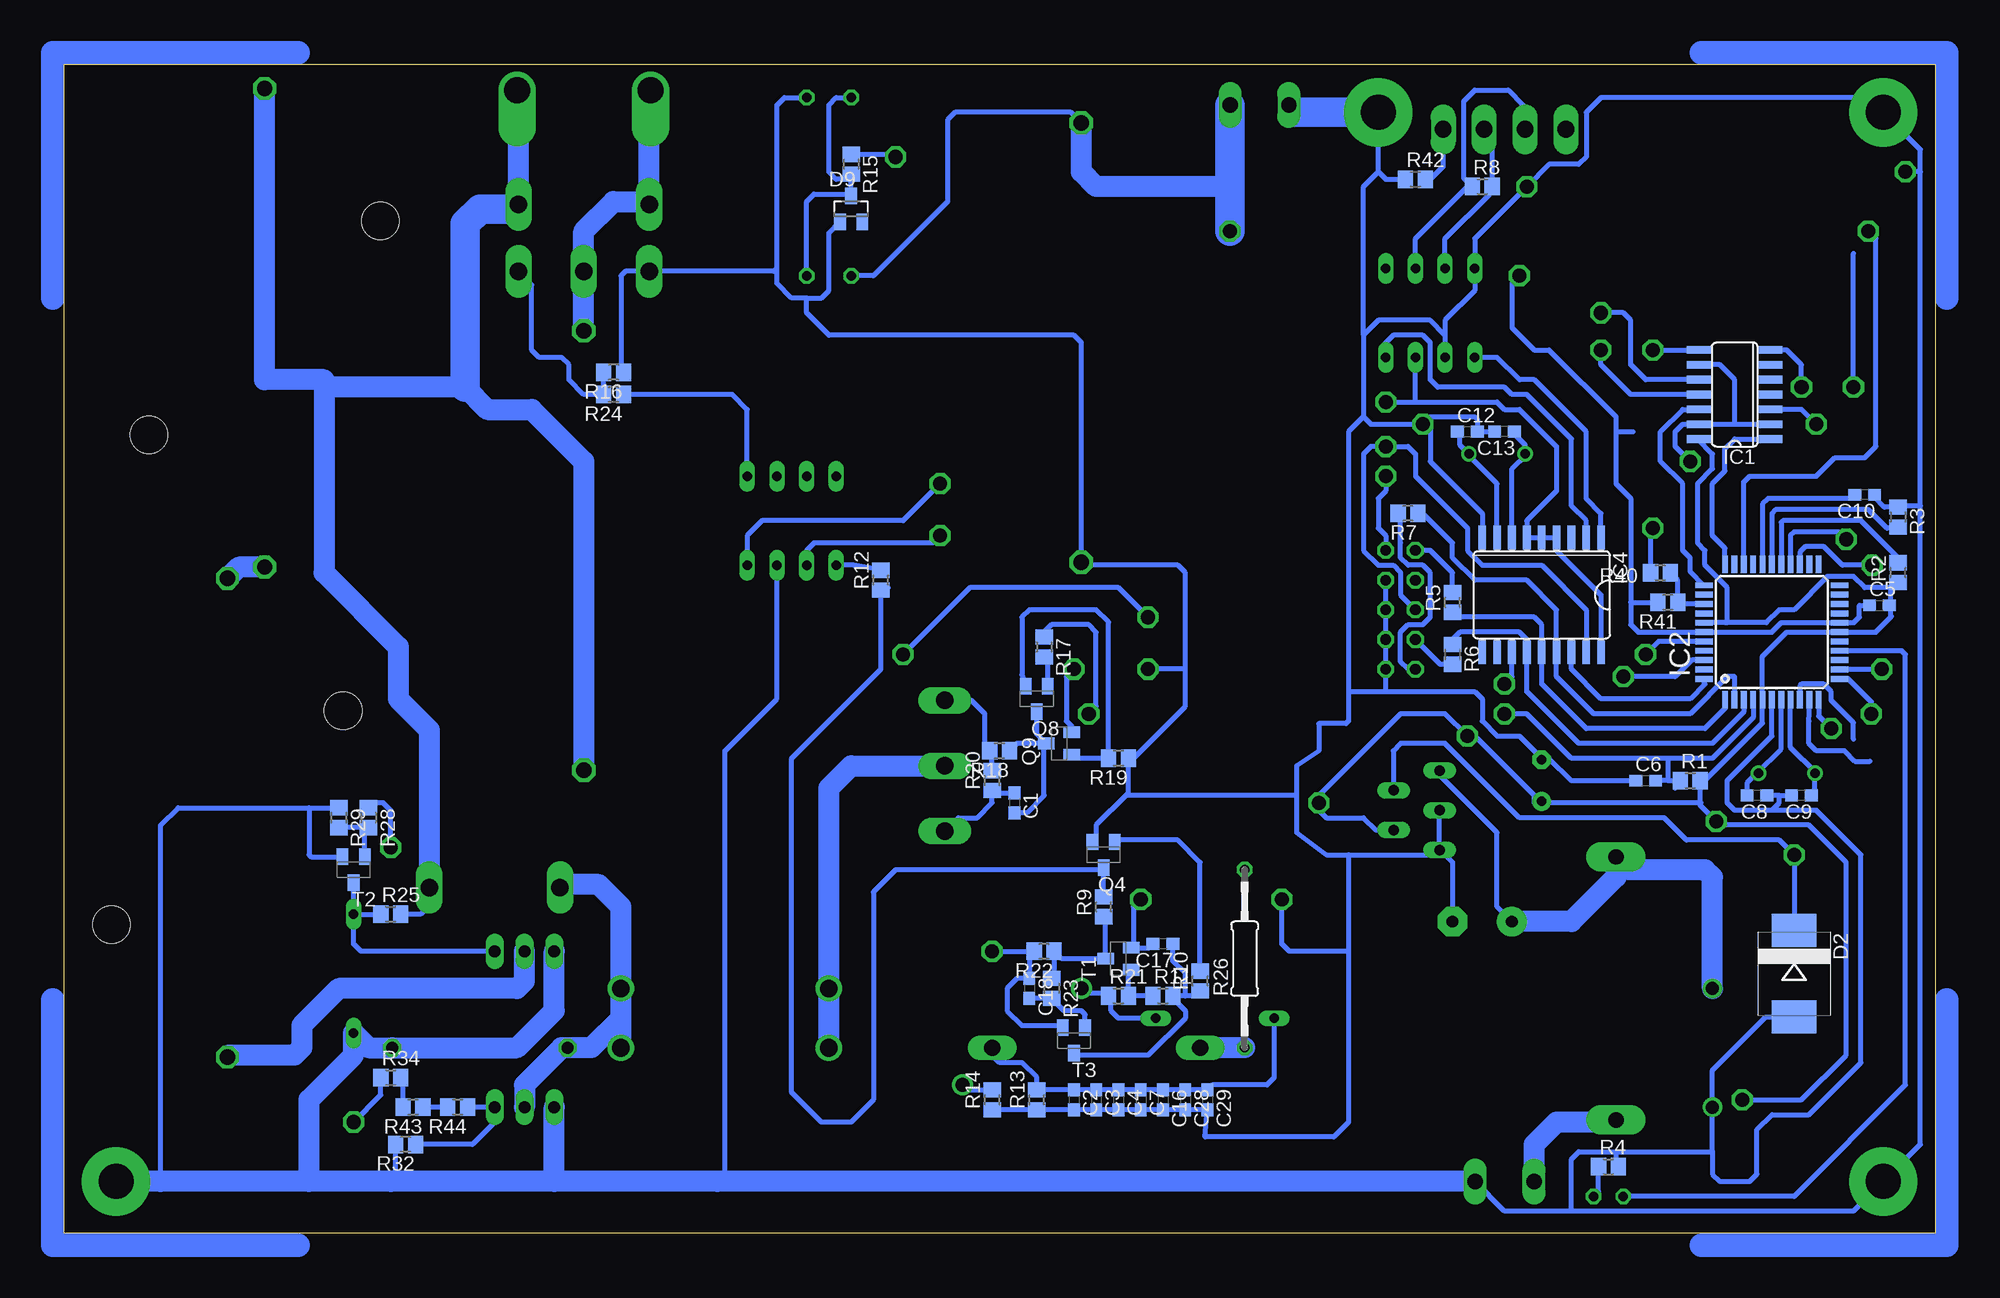
[diagram p5: board, bottom side, seen from below]

Size 160 x 100 mm. Coordinates in mm from the lower left corner, seen from the top.
Outline: 0,0 160,0 160,100 0,100 0,0
Copper layers (1*16): Top 0.035mm / dielectric 1.5mm / Bottom 0.035mm
Design rules "olimex_10mils": minimum track width 10mil, minimum drill 24mil, track to track 10mil, track to pad 10mil, pad to pad 10mil, via to via 10mil, smd to smd 10mil, copper to edge 40mil, drill to drill 10mil, minimum pad ring 10mil, minimum via ring 8mil, stop-mask expansion 0mil, vias tented up to drill 0mil, thermal gap 10mil

### Footprints (pad centres in the part's own frame; a part is rotated, then mirrored left to right if it is on the bottom)
C0603 = smd 1.1 x 1: 1 -0.85,0; 2 0.85,0
C375-192X418 = drill 1.321 octagon: 1 -18.796,0; 2 18.796,0
E5-10,5 = drill 1.016 pad 2.54 round: + -2.54,0 | drill 1.016 pad 2.54 octagon: - 2.54,0
E3,5-10 = drill 0.813 pad 1.6 round: + -1.778,0 | drill 0.813 pad 1.6 octagon: - 1.778,0
C150-054X183 = drill 1.016 octagon: 1 -7.493,0; 2 7.493,0
90-4 = drill 1.422 long: 1 -5.25,5.25; 2 -1.75,5.25; 3 1.75,5.25; 4 5.25,5.25
AK500/2-H = drill 1.321 long: 1 -2.515,0; 2 2.515,0
DO41-10 = drill 1.118 round: A 5.08,0; C -5.08,0
SMC = smd 2.8 x 3.8: A 3.7,0; C -3.7,0
CB429-17 = drill 1.397 long: A 8.89,0; C -8.89,0
DO35-10 = drill 0.813 long: A 5.08,0; C -5.08,0
TO247AD = drill 1.499 long: A 5.588,-0.381; K -5.588,-0.381
DO35Z10 = drill 0.813 long: A 5.08,0; C -5.08,0
SOT23 = smd 1 x 1.4: 1 -0.95,-1.1; 2 0.95,-1.1; 3 0,1.1
SH22,5A = drill 1.321 pad 2.54 long: 1 -11.252,0; 2 11.252,0
3,0-PAD = drill 3 pad 5.842 round: B3,0 0,0
SO14 = smd 0.66 x 2.032: 1 -3.81,-3.073; 2 -2.54,-3.073; 3 -1.27,-3.073; 4 0,-3.073; 5 1.27,-3.073; 6 2.54,-3.073; 7 3.81,-3.073; 8 3.81,3.073; 9 2.54,3.073; 10 1.27,3.073; 11 0,3.073; 12 -1.27,3.073; 13 -2.54,3.073; 14 -3.81,3.073
TQFP44 = smd 1.5 x 0.5: 1 -5.8,4; 2 -5.8,3.2; 3 -5.8,2.4; 4 -5.8,1.6; 5 -5.8,0.8; 6 -5.8,0; 7 -5.8,-0.8; 8 -5.8,-1.6; 9 -5.8,-2.4; 10 -5.8,-3.2; 11 -5.8,-4; 23 5.8,-4; 24 5.8,-3.2; 25 5.8,-2.4; 26 5.8,-1.6; 27 5.8,-0.8; 28 5.8,0; 29 5.8,0.8; 30 5.8,1.6; 31 5.8,2.4; 32 5.8,3.2; 33 5.8,4 | smd 0.5 x 1.5: 12 -4,-5.8; 13 -3.2,-5.8; 14 -2.4,-5.8; 15 -1.6,-5.8; 16 -0.8,-5.8; 17 0,-5.8; 18 0.8,-5.8; 19 1.6,-5.8; 20 2.4,-5.8; 21 3.2,-5.8; 22 4,-5.8; 34 4,5.8; 35 3.2,5.8; 36 2.4,5.8; 37 1.6,5.8; 38 0.8,5.8; 39 0,5.8; 40 -0.8,5.8; 41 -1.6,5.8; 42 -2.4,5.8; 43 -3.2,5.8; 44 -4,5.8
DIL08 = drill 0.813 long: 1 -3.81,-3.81; 2 -1.27,-3.81; 3 1.27,-3.81; 4 3.81,-3.81; 5 3.81,3.81; 6 1.27,3.81; 7 -1.27,3.81; 8 -3.81,3.81
SO18L = smd 0.66 x 2.032: 1 -5.08,-4.902; 2 -3.81,-4.902; 3 -2.54,-4.902; 4 -1.27,-4.902; 5 0,-4.902; 6 1.27,-4.902; 7 2.54,-4.902; 8 3.81,-4.902; 9 5.08,-4.902; 10 5.08,4.902; 11 3.81,4.902; 12 2.54,4.902; 13 1.27,4.902; 14 0,4.902; 15 -1.27,4.902; 16 -2.54,4.902; 17 -3.81,4.902; 18 -5.08,4.902
TO220-51 = drill 0.9 long: 1 -3.4,-8.4; 2 -1.7,-4.5; 3 0,-8.4; 4 1.7,-4.5; 5 3.4,-8.4
CN-2,1 = drill 2.2 offset: >NAME 0,0
PISR = smd 3 x 3: P$1 -7.8,0; P$2 7.8,0
CHIP-LED0805 = smd 1.2 x 1.2: A 0,-1.05; C 0,1.05
LED3MM = drill 0.813 octagon: A -1.27,0; K 1.27,0
ML10 = drill 0.914 octagon: 1 -5.08,-1.27; 2 -5.08,1.27; 3 -2.54,-1.27; 4 -2.54,1.27; 5 0,-1.27; 6 0,1.27; 7 2.54,-1.27; 8 2.54,1.27; 9 5.08,-1.27; 10 5.08,1.27
HC49/S = drill 0.813 round: 1 -2.413,0; 2 2.413,0
HC49U-V = drill 0.813 round: 1 -2.413,0; 2 2.413,0
TO220BV = drill 1.016 long: D 0,-2.54; G -2.54,-2.54; S 2.54,-2.54
SOT23-BEC = smd 1 x 1.4: B -0.95,-1.1; C 0,1.1; E 0.95,-1.1
TO247BV = drill 1.499 long: D 0,-2.921; G -5.588,-2.921; S 5.588,-2.921
R0805 = smd 1.3 x 1.5: 1 -0.85,0; 2 0.85,0
0207/15 = drill 0.813 octagon: 1 -7.62,0; 2 7.62,0
HS25 = drill 1.3 octagon: 1 -20.47,0; 2 20.47,0 | hole 3.2: 9.15,9.9; -9.15,-9.9
TO247BV' = drill 1.499 long: D 0,-0.381; G -5.588,-0.381; S 5.588,-0.381
DIL08' = drill 0.813 long: 1 -1.27,-3.81; 2 1.27,-3.81; 3 3.81,-3.81; 4 6.35,-3.81; 5 6.35,3.81; 6 3.81,3.81; 7 1.27,3.81; 8 -1.27,3.81
CN-TJ6-U1-2 = drill 1.5 round: 11 -8.89,2.54; 12 -8.89,-2.54; 21 8.89,2.54; 22 8.89,-2.54
TO220BV' = drill 1.016 long: D -2.54,2.54; G -5.08,2.54; S 0,2.54

### Placement (x,y rotation side)
C1  78.74,36.83 270 bottom
C2  73.66,11.43 270 bottom
C3  71.75,11.43 270 bottom
C4  69.85,11.43 270 bottom
C5  4.76,53.72 0 bottom
C6  24.77,38.73 0 bottom
C7  67.94,11.43 270 bottom
C8  15.24,37.47 180 bottom
C9  11.43,37.47 180 bottom
C10  6.03,63.18 180 bottom
C11  73.03,76.2 90 top
C12  40.01,68.58 0 bottom
C13  36.83,68.58 180 bottom
C14  38.73,26.67 0 top
C15  33.66,38.73 90 top
C16  66.04,11.43 270 bottom
C17  66.04,24.77 180 bottom
C18  77.47,20.95 270 bottom
C19  124.46,15.88 0 top
C27  115.57,58.42 90 top
C28  64.14,11.43 270 bottom
C29  62.23,11.43 270 bottom
CAN  36.83,99.69 180 top
CAPACITOR  57.78,96.52 180 top
D1  19.05,15.88 270 top
D2  12.06,22.23 270 bottom
D3  71.75,15.88 0 top
D4  61.59,18.41 180 top
D5  123.19,29.21 180 top
D6  115.57,87.63 180 top
D7  135.25,22.23 270 top
D9  92.71,87.63 0 bottom
F1  27.3,20.95 90 top
H1  4.45,95.89 0 top
H2  4.45,4.45 0 top
H3  47.62,95.89 0 top
H4  155.57,4.45 0 top
IC1  17.14,71.75 90 bottom
IC2  13.97,51.44 90 bottom
IC3  43.18,78.74 0 top
IC4  33.66,54.61 180 bottom
IC5  50.8,36.2 270 top
IN  109.86,97.79 270 top
L1  8.89,21.59 270 top
LED1  8.26,53.98 180 top
LED2  5.71,53.98 180 top
LED3  14.61,48.9 0 top
LED4  17.14,48.9 0 top
ON  27.94,3.17 0 top
OUT  121.28,97.79 270 top
POWER  36.83,4.45 0 top
PROG  45.72,53.34 270 top
Q1  12.7,39.37 0 top
Q2  37.47,66.67 0 top
Q3  120.65,21.59 180 top
Q4  71.12,32.38 180 bottom
Q7  115.57,79.38 180 top
Q8  76.83,45.72 180 bottom
Q9  74.93,41.91 90 bottom
R1  20.95,38.73 0 bottom
R2  3.17,56.52 90 bottom
R3  3.17,61.28 270 bottom
R4  27.94,5.71 0 bottom
R5  41.27,53.98 90 bottom
R6  41.27,49.53 270 bottom
R7  45.09,61.59 180 bottom
R8  38.73,89.53 0 bottom
R9  71.12,27.94 90 bottom
R10  62.87,21.59 90 bottom
R11  66.04,20.32 0 bottom
R12  90.17,55.88 90 bottom
R13  76.83,11.43 90 bottom
R14  80.64,11.43 90 bottom
R15  92.71,91.44 270 bottom
R16  113.03,73.66 180 bottom
R17  76.2,50.16 270 bottom
R18  80.01,41.27 180 bottom
R19  69.85,40.64 180 bottom
R20  80.64,38.73 90 bottom
R21  69.85,20.32 0 bottom
R22  76.2,24.13 180 bottom
R23  75.56,20.95 270 bottom
R24  113.03,71.75 180 bottom
R25  132.08,27.3 0 bottom
R26  59.05,23.5 90 bottom
R27  142.88,77.47 90 top
R28  133.99,35.56 270 bottom
R29  136.53,35.56 270 bottom
R30  9.53,48.9 90 top
R31  6.99,48.9 90 top
R32  130.81,7.62 180 bottom
R33  146.05,35.56 90 top
R34  132.08,13.34 0 bottom
R36  92.71,89.53 270 top
R37  96.52,89.53 270 top
R38  14.61,52.7 270 top
R39  17.14,52.7 270 top
R40  23.5,56.52 0 bottom
R41  22.86,53.98 180 bottom
R42  44.45,90.17 0 bottom
R43  130.18,10.79 180 bottom
R44  126.36,10.79 180 bottom
T1  69.85,23.5 90 bottom
T2  135.25,31.11 180 bottom
T3  73.66,16.51 180 bottom
U$1  FQA12P20  [TO247BV']  85.09,40.01 270 top
U$2  UC3708NG4  [DIL08']  95.25,60.96 0 top
U$3  103.5,18.41 180 top
U$4  SPA17N80C3  [TO220BV']  118.11,13.34 180 top

### Tracks (layer width: path | path; a pad name or v marks a point on that pad's centre or on a via)
350V  (via drill 1.2 pad 0.41)
  Top 0.406: R26.2 76.2,31.11 79.38,34.29 79.38,51.44 80.01,52.07 84.45,52.07 89.53,57.15 89.53,76.83
  Top 1.778: 121.54,87.63 D6.K | 60.96,85.72 v60.33,85.72
  Top 2.54: 121.54,87.63 123.83,87.63 127.64,83.82 127.64,80.64 120.65,73.66 103.5,73.66 100.33,76.83 89.53,76.83 85.09,76.83 76.2,85.72 60.96,85.72
  Bottom 0.406: R25.2 129.54,27.3 128.91,27.94 128.91,29.46 D5.K | R36.2 90.81,81.92 84.45,88.27 84.45,95.25 83.82,95.89 73.91,95.89 C11.2
  Bottom 1.778: D5.K 128.78,43.05 131.44,45.72 131.44,50.16 137.79,56.52 137.79,72.39 | OUT.>NAME 121.16,97.66 D6.K 121.54,87.63 | C27.1 115.57,66.04 120.02,70.48 123.83,70.48 125.73,72.39 137.79,72.39 | 137.79,72.39 137.79,73.03 142.88,73.03 R27.2 | 60.96,89.53 71.75,89.53 73.03,90.81 C11.2 | 60.33,89.53 60.96,89.53 | 60.33,88.9 60.96,89.53 | 60.33,96.52 CAPACITOR.1
  Bottom 2.54: 125.73,72.39 125.73,86.36 124.46,87.63 121.54,87.63 | v60.33,85.72 60.33,88.9 60.33,89.53 60.33,96.52
+5V  (via drill 1.2 pad 1.78)
  Top 0.406: v46.99,71.12 48.9,71.12 48.9,64.77 | PROG.2 47.62,58.42 | C15.+ 33.66,36.83 | L1.P$2 9.53,13.34 | L1.P$2 10.16,13.97 | L1.P$2 10.16,12.7 11.43,11.43 v16.51,11.43 | 6.99,47.62 5.71,46.35 4.57,46.35 3.68,45.47 3.68,43.43 5.33,41.78 5.33,35.56 18.41,35.56 v18.73,35.24 | 6.99,47.62 R31.1 | 6.99,47.62 9.53,47.62 R30.1 9.53,48.26 10.79,48.26 12.06,49.53 12.06,51.44 13.97,53.34 14.61,53.34 | 48.9,64.77 48.9,46.99 46.35,44.45 41.91,44.45 v40.01,42.55 | 48.9,64.77 v46.99,64.77 | 14.61,53.34 R38.1 | R39.1 16.93,53.34 14.61,53.34 | v52.7,36.83 53.34,36.83 53.98,36.2 53.98,26.67 54.61,26.04 68.58,26.04 72.39,29.84 80.01,29.84 80.64,29.21 v80.64,24.13
  Bottom 0.406: IC4.18 28.57,54.61 32.38,58.42 IC4.4 32.38,59.69 32.56,59.51 IC4.5 33.66,59.69 33.83,59.51 IC4.6 34.92,60.96 32.38,63.5 32.38,67.31 35.56,70.48 36.83,70.48 37.47,71.12 44.45,71.12 | 17.78,52.39 17.78,52.23 14.44,52.23 13.34,53.34 12.06,53.34 9.21,56.2 6.99,56.2 6.03,55.24 3.81,55.24 | 17.78,52.39 17.78,55.24 19.68,57.15 19.68,58.42 20.32,59.05 20.32,64.14 19.05,65.41 19.05,66.67 20.32,67.94 IC1.14 | R1.2 19.68,38.73 14.77,43.65 IC2.5 14.77,49.37 12.7,51.44 IC2.17 5.08,51.44 3.75,52.77 3.81,52.77 3.81,53.34 | R1.2 20.32,38.73 | PROG.2 46.99,59.69 47.62,60.33 47.62,62.87 46.99,63.5 v46.99,64.77 | IC5.4 47.83,34.49 48.9,35.56 52.07,35.56 52.7,36.2 v52.7,36.83 52.7,37.47 45.72,44.45 41.91,44.45 v40.01,42.55 39.37,42.55 34.29,37.47 34.29,36.83 33.66,36.83 | IC2.38 17.93,52.23 17.78,52.39 | v16.51,11.43 11.43,11.43 7.62,15.24 7.62,31.75 10.79,34.92 18.41,34.92 v18.73,35.24 20.11,36.62 20.11,36.83 | 20.11,36.83 R1.2 | 33.66,36.83 C15.+ | 20.11,36.83 20,36.83 | 20.11,36.83 33.66,36.83 | R2.1 3.17,55.24 3.81,55.24 | 3.81,53.34 3.81,55.24 | 3.81,53.34 C5.2 | v46.99,71.12 44.45,71.12 | 44.45,71.12 IC3.3 | T3.E 74.78,17.78 78.11,17.78 79.38,19.05 79.38,20.95 78.53,21.8 C18.1 77.47,23.71 R22.2 v80.64,24.13
+24V  (via drill 1.2 pad 1.78)
  Top 0.406: 24.13,60.96 v24.13,60.33 22.86,59.05 22.86,39.37 27.3,34.92 F1.2 | U$2.6 99.06,73.66 98.42,74.3 92.08,74.3 91.44,73.66 91.44,55.24 86.36,50.16 81.92,50.16 81.28,49.53 81.28,34.92 81.92,34.29 84.45,34.29
  Top 1.778: D1.C 24.77,20.95 26.04,19.68 50.8,19.68 52.7,17.78 52.7,6.99 85.09,6.99 87,8.89 87,19.05 85.72,20.32 85.72,33.02 84.45,34.29 84.58,34.29 U$1.S
  Bottom 0.406: C1.1 80.44,37.68 R20.1 80.64,36.83 81.92,35.56 83.57,35.56 U$1.S | IC5.1 42.4,39.23 37.47,34.29 37.47,27.94 C14.+ | R40.1 24.34,60.11 v24.13,60.33
  Bottom 1.778: D1.C 19.05,30.48 19.68,31.11 26.21,31.11 F1.2 27.3,30.48 31.11,26.67 C14.+
ADC_250V1
  Bottom 0.406: R37.2 96.52,88.27 95.89,88.9 92.88,88.9 D9.3 R15.2 93.13,90.17 93.98,90.17 94.61,90.81 94.61,96.52 93.98,97.16 R36.1
ADC_NORM  (via drill 1.2 pad 1.78)
  Top 0.406: v5.71,85.72 5.08,86.36 5.08,90.81 9.53,95.25 28.57,95.25 29.21,94.61 29.21,92.71 31.11,90.81 32.38,90.81 33.02,90.17 33.02,81.28 34.29,80.01 48.26,80.01 49.53,81.28 49.53,90.81 50.8,92.08 66.04,92.08 67.94,93.98 67.94,97.79 68.58,98.42 87.63,98.42 88.9,97.16 v88.9,92.08
  Bottom 0.406: IC2.31 16.37,64.28 15.88,64.77 10.16,64.77 8.57,66.36 6.03,66.36 5.08,67.31 5.08,85.09 v5.71,85.72 | R15.1 89.11,92.29 v88.9,92.08
ADC_SUPPLY
  Bottom 0.406: IC2.36 21.87,53.84 R41.1 22.01,55.88 R40.2
CS
  Bottom 0.406: IC4.16 31.11,48.26 28.57,45.72 20.95,45.72 19.68,46.99 19.77,47.08 IC2.44
GND  (via drill 1.2 pad 1.78)
  Top 0.406: v11.43,72.39 v6.99,72.39 2.54,76.83 v2.54,90.81 | v35.56,81.92 35.56,88.9 v34.92,89.53 | v55.88,28.57 v67.94,28.57 | v67.31,48.26 v73.66,48.26
  Bottom 0.406: 12.06,37.47 C9.2 13.34,37.47 | 13.34,37.47 C8.1 | IC2.6 13.97,42.55 17.78,38.73 17.78,36.83 17.14,36.2 13.97,36.2 | 13.34,37.47 13.34,36.83 13.97,36.2 | R4.2 27.09,5.29 | R4.2 26.67,5.71 27.3,6.35 27.3,6.99 | 31.11,1.91 6.99,1.91 H2.B3,0 1.27,7.62 1.27,62.23 | 31.11,1.91 36.83,1.91 39.37,4.45 | 13.97,36.2 10.16,36.2 6.35,32.38 6.35,14.61 10.79,10.16 13.97,10.16 15.24,8.89 15.24,5.08 15.88,4.45 18.41,4.45 19.05,5.08 19.05,6.99 | R4.2 27.3,5.71 | PROG.4 PROG.6 PROG.8 PROG.10 46.99,46.35 | 13.97,75.56 IC1.7 12.7,75.56 11.43,74.3 v11.43,72.39 | 27.3,68.58 27.3,64.14 26.04,62.87 26.04,53.98 | 1.27,62.23 1.27,90.81 | 1.27,90.81 1.27,92.71 H1.B3,0 5.71,97.16 28.57,97.16 29.84,95.89 29.84,92.08 30.48,91.44 33.02,91.44 v34.92,89.53 39.37,85.09 IC3.8 39.37,80.64 41.91,78.11 41.91,76.83 | 41.91,76.83 43.18,78.11 47.62,78.11 48.9,76.83 | 41.91,76.83 IC3.2 | C6.1 31.11,38.73 33.02,40.64 33.66,40.64 | 27.3,6.99 30.48,6.99 31.11,6.35 31.11,1.91 | 33.66,40.64 C15.- | 33.66,40.64 35.56,42.55 37.47,42.55 38.73,43.81 38.73,45.72 39.37,46.35 46.99,46.35 | IC5.3 42.4,33.16 42.55,33.02 | 26.04,53.98 26.04,52.07 25.4,51.44 IC2.39 13.97,51.44 13.17,52.23 IC2.18 6.95,52.23 6.48,52.7 6.48,53.72 C5.1 | D2.A 14.49,18.52 19.05,13.97 D1.A 19.05,6.99 | 27.3,6.99 19.05,6.99 | 47.62,90.81 H3.B3,0 | 47.62,90.81 48.9,89.53 48.9,76.83 | C10.1 5.18,62.97 4.34,62.13 R3.1 3.07,62.23 1.27,62.23 | C14.- 41.27,31.75 42.55,33.02 | v35.56,81.92 36.2,81.28 36.2,77.47 34.29,75.56 33.02,75.56 27.3,69.85 27.3,68.58 | 1.27,90.81 v2.54,90.81 | 50.16,32.38 42.81,32.38 IC5.5 42.55,32.94 42.55,33.02 | 27.3,68.58 25.82,68.58
  Bottom 0.406: 43.18,69.85 39.37,69.85 39.16,69.64 39.16,69 38.73,68.58 | 43.18,69.85 v43.81,69.22 48.26,69.22 48.9,69.85 | IC4.9 38.73,61.59 43.18,66.04 43.18,69.85 | 48.9,76.83 48.9,69.85 | 50.16,46.35 50.16,43.81 50.38,43.6 52.7,43.6 52.7,41.27 54.61,40.01 54.61,37.47 | 50.16,46.35 50.16,68.58 48.9,69.85 | 50.16,46.35 46.99,46.35 | R42.1 46.99,90.17 47.62,90.81 | 38.73,68.58 C12.2 | 38.73,68.58 C13.2 | R14.1 R13.1 C2.2 C3.2 C4.2 C7.2 C16.2 C28.2 C29.2 62.45,8.26 51.44,8.26 50.16,9.53 50.16,24.13 | R37.1 98.42,97.16 99.06,96.52 99.06,82.55 | 99.06,82.55 99.06,81.28 97.79,80.01 96.52,80.01 | 96.52,80.01 95.25,80.01 94.61,80.64 94.61,85.58 D9.1 | R16.1 112.39,73.88 112.39,81.92 112.01,82.3 Q7.S 99.31,82.3 99.06,82.55 | C17.2 67.21,24.45 T1.E 68.58,24.27 | 50.16,32.38 50.16,24.13 | 69.22,37.47 69,37.68 R19.1 68.58,40.64 64.14,45.09 64.14,48.26 | 64.14,48.26 64.14,56.52 64.77,57.15 72.77,57.15 C11.1 73.03,76.2 73.66,76.83 94.61,76.83 96.52,78.74 96.52,80.01 | 26.04,53.98 R41.2 | v6.99,72.39 6.99,83.82 | 68.58,24.27 68.58,27.94 v67.94,28.57 | v55.88,28.57 55.88,24.77 55.24,24.13 50.16,24.13 | 50.16,32.38 52.07,32.38 54.61,34.29 54.61,37.47 | R32.2 131.66,4.87 132.08,4.45 | 68.58,24.27 68.58,24.13 | 54.61,37.47 69.22,37.47 | 139.06,36.41 150.28,36.41 151.76,34.92 151.76,4.45 | 139.06,36.41 R29.1 | T2.E 138.9,32.22 139.06,32.38 139.06,36.41 | U$2.3 99.06,45.72 103.5,41.27 103.5,5.08 104.14,4.45 | 69.22,37.47 71.75,34.92 71.75,33.8 Q4.E | Q9.E 73.83,43.35 74.3,43.81 74.3,47.62 v73.66,48.26 | 64.14,48.26 v67.31,48.26
  Bottom 1.778: 118.11,4.45 104.14,4.45 39.37,4.45 POWER.2 | 118.11,4.45 132.08,4.45 139.06,4.45 | 139.06,4.45 151.76,4.45 H4.B3,0 | Q3.S 118.11,19.05 121.28,15.88 C19.2 133.99,15.88 D7.A 135.25,15.24 139.06,11.43 139.06,4.45 | 54.63,95.89 CAPACITOR.2 | 118.11,4.45 U$4.S
  Bottom 2.54: H3.B3,0 54.63,95.89
MISO
  Bottom 0.406: IC2.2 17.14,45.66 17.14,47.62 17.78,47.62 20.95,44.45 29.21,44.45 32.38,47.62 IC4.15 32.38,53.34 34.92,55.88 39.37,55.88 41.27,57.78 41.27,59.05 43.81,61.59 | 43.81,61.59 R7.1 43.81,61.59
MOSI
  Bottom 0.406: IC2.1 17.97,44.9 19.68,43.18 29.84,43.18 33.66,46.99 IC4.14 33.66,52.07 34.29,52.7 41.27,52.7 R5.1
N$1
  Bottom 0.406: ON.A 12.06,3.17 2.54,12.7 2.54,49.53 2.85,49.84 IC2.15
N$2
  Bottom 0.406: IC2.29 14.77,62.38 14.29,62.87 7.3,62.87 6.99,63.18 C10.2
N$3
  Bottom 0.406: IC2.27 13.17,60.81 13.02,60.96 6.35,60.96 3.17,57.78 R2.2 | R2.2 3.17,57.47 | R2.2 3.17,57.15
N$4
  Bottom 0.406: C9.1 10.79,37.47 10.29,37.97 Q1.1 10.16,39.37 12.37,41.58 IC2.8
N$5
  Bottom 0.406: IC2.7 13.17,41.44 15.24,39.37 | Q1.2 15.24,39.37 | C8.2 16.09,38.52 15.24,39.37
N$6
  Bottom 0.406: R5.2 41.27,56.52 43.18,58.42 PROG.1
N$7
  Bottom 0.406: IC2.28 13.97,61.59 13.65,61.91 5.71,61.91 4.13,60.33 3.17,60.33 R3.2
N$8
  Bottom 0.406: R6.2 42.33,48.68 43.18,49.53 PROG.7
N$9
  Bottom 0.406: PROG.9 45.09,48.26 45.72,48.9 45.72,51.44 45.09,52.07 43.81,52.07 43.18,52.7 43.18,56.52 43.81,57.15 45.09,57.15 45.72,57.78 45.72,59.05 45.72,60.33 45.72,61.59 R7.2
N$10
  Bottom 0.406: R16.2 R24.2 115.57,71.75 116.84,73.03 116.84,74.3 117.47,74.93 119.38,74.93 120.02,75.56 120.02,81.15 Q7.G
N$11
  Bottom 0.406: U$2.1 92.5,57.15 R12.2
N$12
  Bottom 0.406: IC4.1 28.57,61.59 29.84,62.87 29.84,68.58 34.29,73.03 35.56,73.03 37.47,74.93 IC3.1
N$13
  Top 2: 20,-1 -1,-1 -1,20
N$14
  Bottom 0.406: D3.A 80.64,15.24 80.01,14.61 78.11,14.61 76.83,13.34 R13.2 C2.1 C3.1 C4.1 C7.1 C16.1 C28.1 C29.1 61.81,12.7 57.15,12.7 56.52,13.34 D4.A
N$15
  Bottom 0.406: R10.2 62.87,31.75 64.77,33.66 70,33.66 Q4.B
N$16
  Bottom 0.406: R23.2 75.25,19.79 | T3.B 72.71,18.73 73.03,19.05 74.51,19.05 R23.2 | R23.2 C18.2
N$18
  Bottom 0.406: T1.B 69,22.3 R21.2 R11.1
N$19  (via drill 1.2 pad 0.41)
  Top 0.406: v28.57,75.56 33.02,75.56 34.92,77.47 48.9,77.47 61.59,64.77 84.45,64.77 v85.09,64.14
  Bottom 0.406: U$2.4 101.6,59.69 100.33,60.96 88.27,60.96 v85.09,64.14 | v28.57,75.56 28.57,74.3 26.04,71.75 IC1.11 19.68,71.75
N$20
  Bottom 0.406: R43.2 131.03,13.13 R34.2
N$21
  Top 2: 140,-1 161,-1 161,20
N$22
  Bottom 0.406: IC4.2 29.84,60.96 31.11,62.23 31.11,67.94 34.92,71.75 36.2,71.75 36.83,72.39 42.55,72.39 43.18,73.03 43.18,76.2 43.81,76.83 46.35,76.83 46.99,76.2 IC3.4
N$23
  Bottom 1.778: D5.A 117.35,29.84 114.3,29.84 112.39,27.94 U$3.12 U$3.11 112.39,18.41 114.94,15.88 C19.1 117.47,15.88 120.65,12.7 U$4.D
N$24
  Bottom 0.406: CAN.3 35.23,94.3 35.24,94.3 35.24,96.52 36.51,97.79 39.37,97.79 40.32,96.84 40.32,90.27 R8.1 40.01,89.53 44.45,85.09 IC3.6
N$25
  Bottom 0.406: R44.1 U$4.G 123.19,9.53 125.09,7.62 R32.1
N$26
  Top 2: 20,101 -1,101 -1,80
N$27  (via drill 1.2 pad 1.78)
  Top 0.406: v83.19,12.7 83.19,13.97 74.3,13.97 73.03,15.24 v73.03,20.95
  Bottom 0.406: D4.C 69.85,18.41 70.48,19.05 70.48,20.11 R21.1 70.7,20.54 72.61,20.54 v73.03,20.95 | R14.2 82.77,12.28 v83.19,12.7
N$28
  Bottom 1.778: R26.1 D3.C
N$29
  Bottom 0.406: R20.2 80.64,41.06 R18.2 81.28,41.7 81.28,44.45 82.42,45.59 U$1.G
N$30  (via drill 1.2 pad 1.78)
  Top 0.406: L1.P$1 9.98,29.84 v12.06,32.38
  Bottom 0.406: 46.35,38.1 46.3,38.05 IC5.2 46.35,37.95 46.35,38.1 | 46.35,38.1 46.35,41.27 45.72,41.91 41.91,41.91 35.56,35.56 23.18,35.56 21.27,33.66 13.34,33.66 v12.06,32.38 D2.C
N$31
  Bottom 0.406: R4.1 28.79,3.6 ON.K
N$32
  Bottom 1.778: Q3.D 120.65,21.59 121.28,20.95 136.53,20.95 139.7,17.78 139.7,15.88 140.34,15.24 145.9,15.24 R33.1
N$33
  Bottom 1.778: R27.1 145.08,57 R33.2
N$34
  Bottom 0.406: D7.C T2.C | Q3.G 134.62,24.13 135.25,24.77 D7.C | D7.C R25.1
N$36  (via drill 1.2 pad 0.41)
  Top 0.406: v28.57,78.74 50.16,78.74 61.59,67.31 87,67.31 87.63,66.67 87.63,60.96 86.36,59.69 v85.09,59.69
  Bottom 0.406: IC1.10 24.77,73.03 26.04,74.3 26.04,78.11 26.67,78.74 v28.57,78.74 | U$2.2 96.52,58.42 95.89,59.05 85.72,59.05 v85.09,59.69
N$38
  Bottom 0.406: T2.B 134.31,34.39 R28.2 R29.2
N$40
  Top 2: 161,80 161,101 140,101
N$41
  Bottom 2: 20,-1 -1,-1 -1,20
N$42  (via drill 1.2 pad 1.78)
  Top 0.406: v36.83,46.99 27.3,46.99 v26.67,47.62
  Bottom 0.406: IC4.12 36.2,47.62 v36.83,46.99 | IC2.42 20.82,49.03 22.23,47.62 v26.67,47.62
N$43
  Bottom 1.778: POWER.1 34.31,7.59 32.38,9.53 27.48,9.53 F1.1
N$44
  Top 0.406: LED2.C 5.71,52.7 6.99,51.44 R31.2
N$45
  Top 0.406: LED1.C 8.26,52.7 9.53,51.44 R30.2
N$46
  Bottom 0.406: R42.2 43.18,90.17 42.08,91.27 CAN.1
N$47  (via drill 1.2 pad 1.78)
  Top 0.406: 48.56,23.27 48.26,22.86 | 48.56,23.27 50.16,25.4 50.16,38.1 50.8,38.73 71.12,38.73 72.39,40.01 v72.39,44.45 | v10.16,69.22 3.17,69.22 1.27,67.31 1.27,24.77 6.35,22.86 7.62,21.59 15.24,21.59 18.41,24.77 29.21,24.77 31.11,22.86 48.16,22.86 48.56,23.27
  Bottom 0.406: IC1.3 11.43,70.48 v10.16,69.22 | R17.1 76.2,51.44 75.56,52.07 72.39,52.07 71.75,51.44 71.75,45.09 v72.39,44.45
N$48  (via drill 1.2 pad 1.78)
  Top 0.406: LED1.A 8.26,55.24 7.62,55.88 v7.62,59.37
  Bottom 0.406: IC2.26 12.37,59.7 12.06,60.01 8.26,60.01 v7.62,59.37
N$49  (via drill 1.2 pad 1.78)
  Top 0.406: LED2.A 5.71,55.24 5.4,55.56 v5.4,57.15
  Bottom 0.406: IC2.25 11.57,58.28 11.11,58.74 9.53,58.74 7.94,57.15 v5.4,57.15
N$50
  Bottom 0.406: R44.2 R43.1
N$51
  Bottom 2: 140,-1 161,-1 161,20
N$53
  Bottom 0.406: C13.1 36.2,68.58 35.05,67.44 Q2.1 34.92,66.67 36.2,65.41 IC4.7
N$54
  Bottom 0.406: C12.1 40.64,68.58 40.64,67.44 Q2.2 40.01,66.67 37.47,64.14 IC4.8
N$55
  Bottom 0.406: 110.17,97.47 IN.>NAME
  Bottom 1.778: 110.49,97.79 110.17,97.47 109.98,97.28 D6.A 110.24,88.27 113.03,88.27 115.57,85.72 Q7.D C27.2
N$56
  Bottom 2: 20,101 -1,101 -1,80
N$57
  Bottom 2: 161,80 161,101 140,101
N$58
  Top 0.406: LED3.C R38.2
N$59
  Bottom 0.406: 38.58,94.46 38.73,94.61 | 38.58,94.46 CAN.2 | 38.58,94.46 37.88,93.77 R8.2 38.1,89.53 38.1,88.9 41.91,85.09 IC3.7
N$60
  Top 0.406: LED4.C R39.2
N$61  (via drill 1.2 pad 1.78)
  Top 0.406: LED3.A 13.12,46.35 8.26,46.35 6.99,45.09 6.1,45.09 v5.46,44.45
  Bottom 0.406: IC2.12 7.43,47.44 5.46,45.47 v5.46,44.45
N$62  (via drill 1.2 pad 1.78)
  Top 0.406: LED4.A 17.14,46.99 13.34,43.18 v8.89,43.18
  Bottom 0.406: IC2.11 9.97,44.26 v8.89,43.18
N$63
  Bottom 0.406: C1.2 77.69,35.98 76.2,37.47 76.2,41.74 Q9.C | 78.99,41.1 R18.1 78.53,41.91 Q9.C | Q9.C 76.2,42.08 | Q8.C 76.83,42.72 Q9.C
N$64
  Bottom 0.406: Q8.E 78.11,47.77 78.11,52.7 77.47,53.34 71.75,53.34 70.7,52.28 R19.2 73.51,40.64 Q9.B
N$65
  Bottom 0.406: Q8.B 75.89,49 R17.2
N$100
  Bottom 0.406: R9.2 Q4.C 71.29,31.11 88.9,31.11 90.81,29.21 90.81,11.43 92.71,9.53 95.25,9.53 97.79,12.06 97.79,40.64 90.17,48.26 90.17,54.61 89.53,55.24 89.95,55.24 R12.1
NOTABSCHALTUNG
  Bottom 0.406: 64.14,20.32 63.28,20.32 R10.1 | 64.14,20.32 R11.2 65.19,20.11 64.14,19.05 64.14,18.41 67.31,15.24 73.49,15.24 T3.C | C17.1 65.19,23.28 64.14,22.23 64.14,20.32
NOTABSCHALTUNG_B
  Bottom 0.406: R23.1 75.35,22.02 R22.1 74.72,23.5 T1.C 70.95,26.92 R9.1
ON_HOLD  (via drill 1.2 pad 0.41)
  Top 0.406: v132.08,33.02 132.08,34.92 131.44,35.56 100.97,35.56 88.27,48.26 v88.27,49.53 | v24.77,49.53 24.77,44.45 26.04,43.18 34.29,43.18 37.47,40.01 40.01,40.01 42.55,42.55 57.15,42.55 v67.31,52.7
  Bottom 0.406: IC2.40 23.66,50.63 v24.77,49.53 | v132.08,33.02 132.08,36.2 132.72,36.83 133.35,36.83 133.99,36.2 R28.1 | v88.27,49.53 82.55,55.24 69.85,55.24 v67.31,52.7
POW_ON
  Bottom 0.406: IC2.33 17.97,58.61 19.05,59.69 19.05,64.14 17.97,65.22 17.97,67.12 17.14,67.94 IC1.1
POWER_BOOSTER
  Bottom 1.778: U$1.D 92.71,40.01 94.61,38.1 U$3.22 U$3.21
PWM_BOOST  (via drill 1.2 pad 1.78)
  Top 0.406: v4.57,48.26 4.57,51.56 3.17,52.96 3.17,58.42 6.35,61.59 10.16,61.59 v24.13,75.56
  Bottom 0.406: v24.13,75.56 IC1.8 | IC2.13 5.05,48.23 v4.57,48.26
PWM_BOOST_OUT  (via drill 1.2 pad 0.41)
  Top 0.406: U$2.7 96.52,62.87 97.16,62.23 124.46,62.23 125.73,60.96 125.73,44.45 129.54,40.64 139.06,40.64 142.24,37.47 142.24,9.53 141.6,8.89 135.89,8.89 v135.25,9.53
  Bottom 0.406: R34.1 132.93,11.85 v135.25,9.53
RELEASE
  Bottom 0.406: IC1.12 21.59,70.48 23.5,68.58 23.5,66.04 21.59,64.14 21.59,58.42 20.95,57.78 20.95,56.62 IC2.34
RELEASE_KICK
  Bottom 0.406: R24.1 102.87,71.75 101.6,70.48 U$2.5
RST  (via drill 1.2, 1.2 pad 1.78)
  Top 0.406: v36.83,44.45 38.1,44.45 41.27,47.62 41.27,59.05 44.45,62.23 44.45,66.67 45.09,67.31 v46.99,67.31 46.99,68.58 44.45,71.12 26.04,71.12 v20.95,66.04
  Bottom 0.406: IC2.4 15.57,44.12 19.05,40.64 22.86,40.64 | 29.84,49.53 IC4.17 29.84,53.34 33.66,57.15 38.73,57.15 40.01,58.42 40.01,60.33 44.45,64.77 44.45,66.67 45.09,67.31 v46.99,67.31 48.26,67.31 48.9,66.67 48.9,58.42 47.62,57.15 46.35,57.15 45.72,56.52 45.72,54.61 PROG.5 | 22.23,38.1 R1.1 22.86,38.73 | v36.83,44.45 34.92,44.45 31.11,40.64 22.86,40.64 | 22.86,38.73 C6.2 | 22.86,40.64 22.86,38.73 | 20.32,74.3 IC1.9 18.41,74.3 17.14,73.03 17.14,69.22 | 17.14,69.22 IC1.13 21.59,69.22 22.23,68.58 22.23,67.31 v20.95,66.04 | 17.14,69.22 IC1.2
RXD
  Bottom 0.406: IC2.9 11.57,46.85 11.43,46.99 9.53,46.99 8.89,46.35 8.89,45.59 6.99,43.69 6.99,42.29
SCK
  Bottom 0.406: IC2.3 16.37,44.59 19.05,41.91 30.48,41.91 34.92,46.35 IC4.13 34.92,50.8 35.56,51.44 40.64,51.44 41.27,50.8 R6.1
TXD
  Bottom 0.406: IC2.10 10.77,44.48 10.79,43.81 10.79,41.91 10.16,41.27 7.75,41.27 6.86,40.39 5.59,40.39

### Text on the board
Top: Carpe Noctem | rekick015 | (c) 2008